# Altium project FPGA_Rack_v1_0.PrjPcb (part 1 of 2)
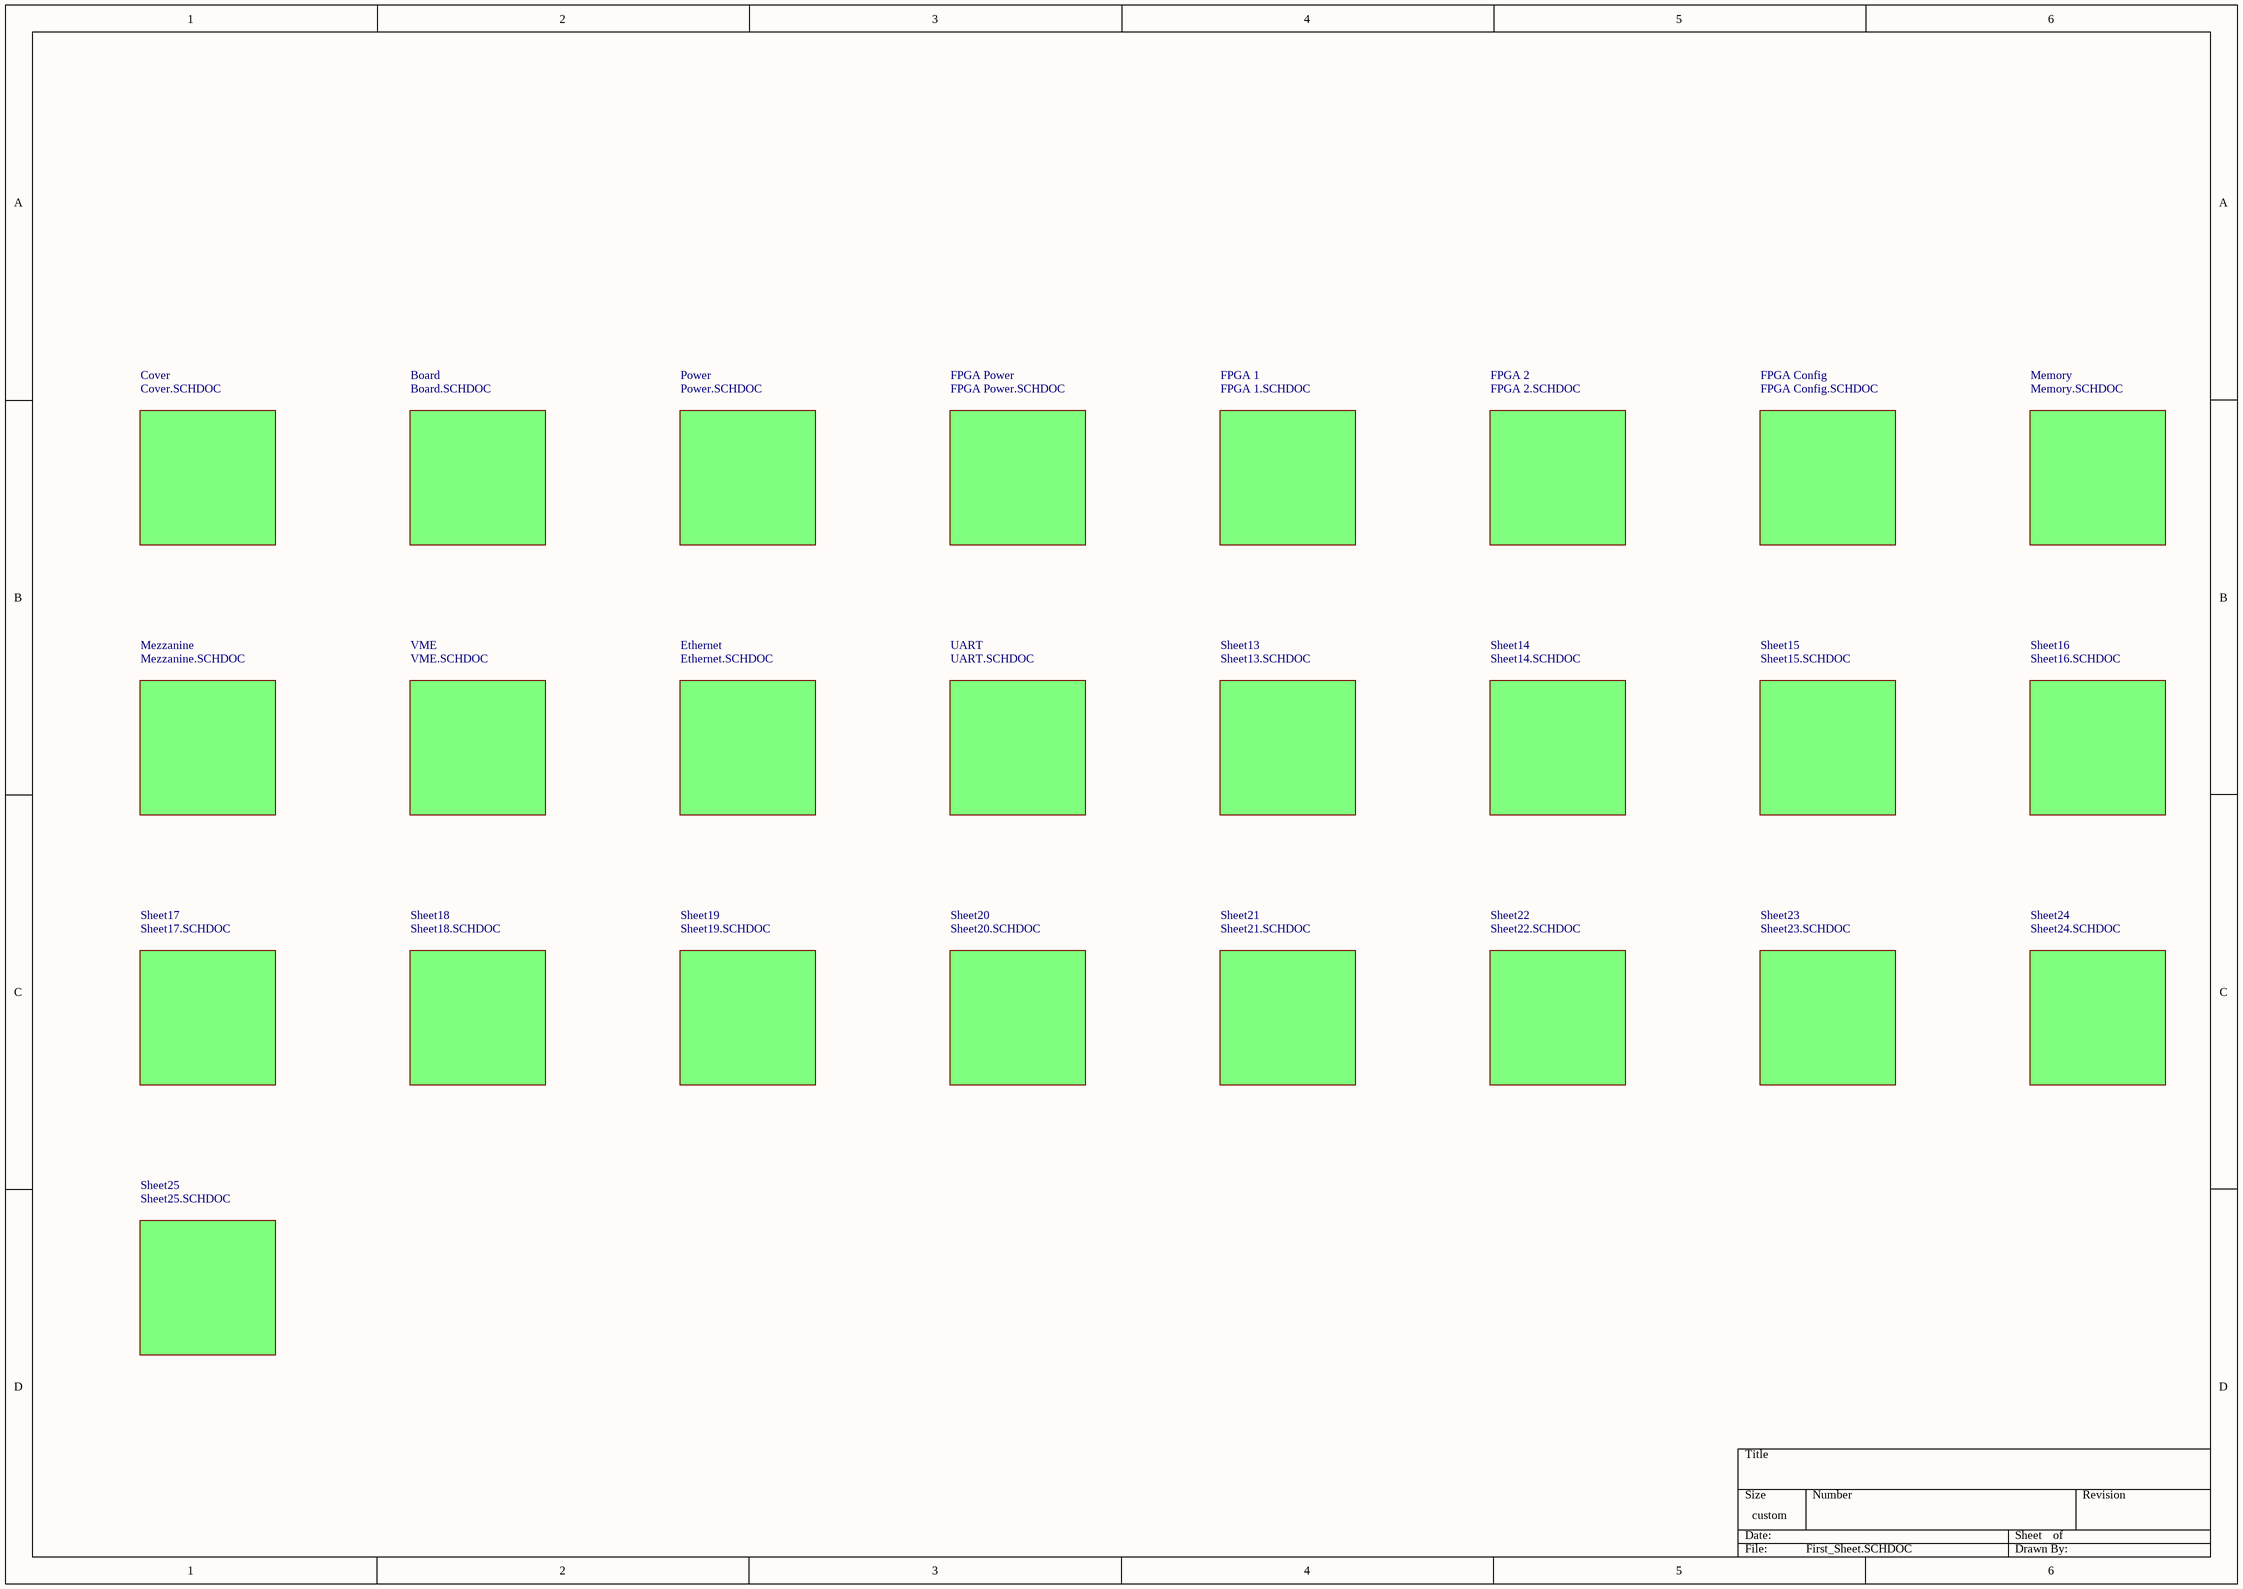
[diagram p0: First_Sheet.SCHDOC]
25 sheets, 208 parts. Net scope: global (net labels, ports and power ports of the same name join across sheets).
Board file: FPGA_Rack_v1_0.PcbDoc
Sheets:
  First_Sheet.SCHDOC
    Cover = Cover.SCHDOC
    Board = Board.SCHDOC
    Power = Power.SCHDOC
    FPGA Power = FPGA Power.SCHDOC
    FPGA 1 = FPGA 1.SCHDOC
    FPGA 2 = FPGA 2.SCHDOC
    FPGA Config = FPGA Config.SCHDOC
    Memory = Memory.SCHDOC
    Mezzanine = Mezzanine.SCHDOC
    Ethernet = Ethernet.SCHDOC
    UART = UART.SCHDOC
    Sheet13 = Sheet13.SCHDOC
    Sheet14 = Sheet14.SCHDOC
    Sheet15 = Sheet15.SCHDOC
    Sheet16 = Sheet16.SCHDOC
    Sheet17 = Sheet17.SCHDOC
    Sheet18 = Sheet18.SCHDOC
    Sheet19 = Sheet19.SCHDOC
    Sheet20 = Sheet20.SCHDOC
    Sheet21 = Sheet21.SCHDOC
    Sheet22 = Sheet22.SCHDOC
    Sheet23 = Sheet23.SCHDOC
    Sheet24 = Sheet24.SCHDOC
    Sheet25 = Sheet25.SCHDOC

## Sheet First_Sheet.SCHDOC
size 420 x 297 mm

### Sub-sheets
Board = Board.SCHDOC: no entries
Cover = Cover.SCHDOC: no entries
Ethernet = Ethernet.SCHDOC: no entries
FPGA 1 = FPGA 1.SCHDOC: no entries
FPGA 2 = FPGA 2.SCHDOC: no entries
FPGA Config = FPGA Config.SCHDOC: no entries
FPGA Power = FPGA Power.SCHDOC: no entries
Memory = Memory.SCHDOC: no entries
Mezzanine = Mezzanine.SCHDOC: no entries
Power = Power.SCHDOC: no entries
Sheet13 = Sheet13.SCHDOC: no entries
Sheet14 = Sheet14.SCHDOC: no entries
Sheet15 = Sheet15.SCHDOC: no entries
Sheet16 = Sheet16.SCHDOC: no entries
Sheet17 = Sheet17.SCHDOC: no entries
Sheet18 = Sheet18.SCHDOC: no entries
Sheet19 = Sheet19.SCHDOC: no entries
Sheet20 = Sheet20.SCHDOC: no entries
Sheet21 = Sheet21.SCHDOC: no entries
Sheet22 = Sheet22.SCHDOC: no entries
Sheet23 = Sheet23.SCHDOC: no entries
Sheet24 = Sheet24.SCHDOC: no entries
Sheet25 = Sheet25.SCHDOC: no entries
UART = UART.SCHDOC: no entries
VME = VME.SCHDOC (file not in this document): no entries

## Sheet Cover.SCHDOC: FPGA Rack
size 420 x 297 mm; DrawnBy: zas; Revision: V1.0; SheetNumber: 1; SheetTotal: 25; DocumentName: Cover.SCHDOC
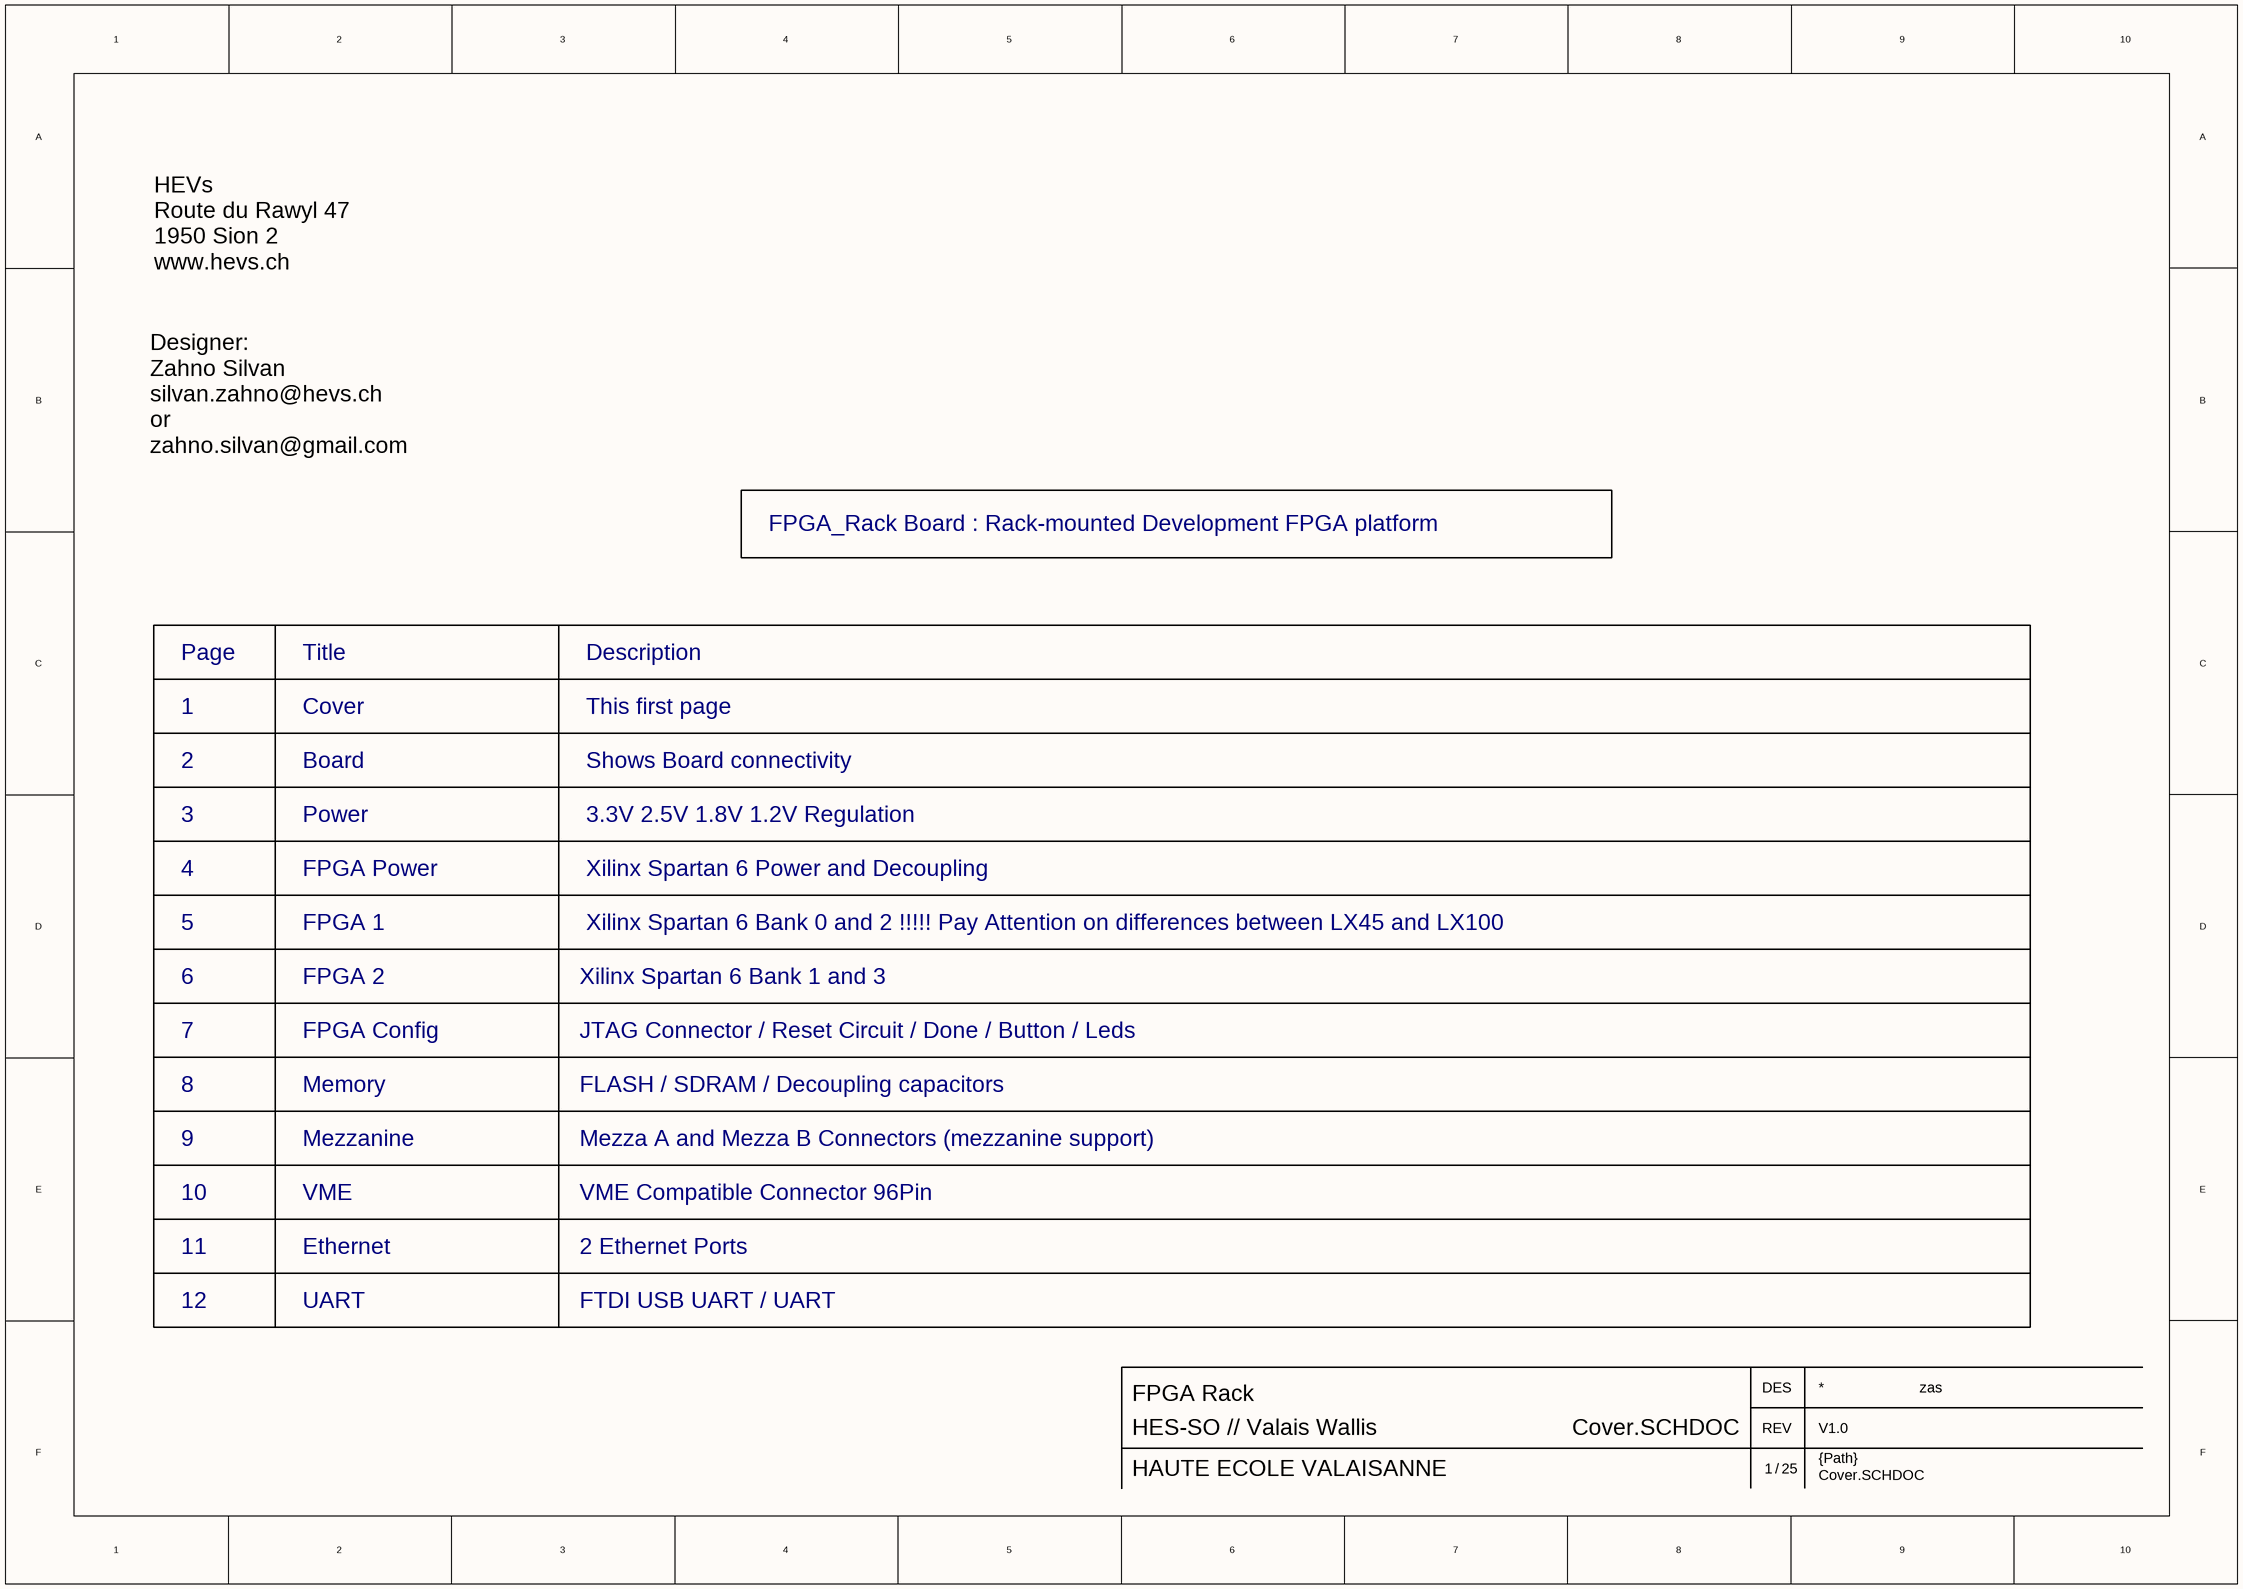
[diagram p1: Cover.SCHDOC]

### Notes on the sheet
- HEVs
  Route du Rawyl 47
  1950 Sion 2
  www.hevs.ch
- Designer:
  Zahno Silvan
  silvan.zahno@hevs.ch
  or
  zahno.silvan@gmail.com
- FPGA_Rack Board : Rack-mounted Development FPGA platform
- Page
- Title
- Description
- 1
- Cover
- This first page
- 2
- Board
- Shows Board connectivity
- 4
- 3
- FPGA Power
- Power
- Xilinx Spartan 6 Power and Decoupling
- 3.3V 2.5V 1.8V 1.2V Regulation
- 5
- FPGA 1
- Xilinx Spartan 6 Bank 0 and 2 !!!!! Pay Attention on differences between LX45 and LX100
- 6
- FPGA 2
- Xilinx Spartan 6 Bank 1 and 3
- 7
- FPGA Config
- JTAG Connector / Reset Circuit / Done / Button / Leds
- 9
- 8
- Mezzanine
- Memory
- Mezza A and Mezza B Connectors (mezzanine support)
- FLASH / SDRAM / Decoupling capacitors
- 10
- VME
- VME Compatible Connector 96Pin
- 11
- Ethernet
- 2 Ethernet Ports
- 12
- UART
- FTDI USB UART / UART
- DES
- HES-SO // Valais Wallis
- HAUTE ECOLE VALAISANNE
- /
- REV
- {Path}

## Sheet Board.SCHDOC: FPGA Rack
size 420 x 297 mm; DrawnBy: zas; Revision: V1.0; SheetNumber: 2; SheetTotal: 25; DocumentName: Board.SCHDOC
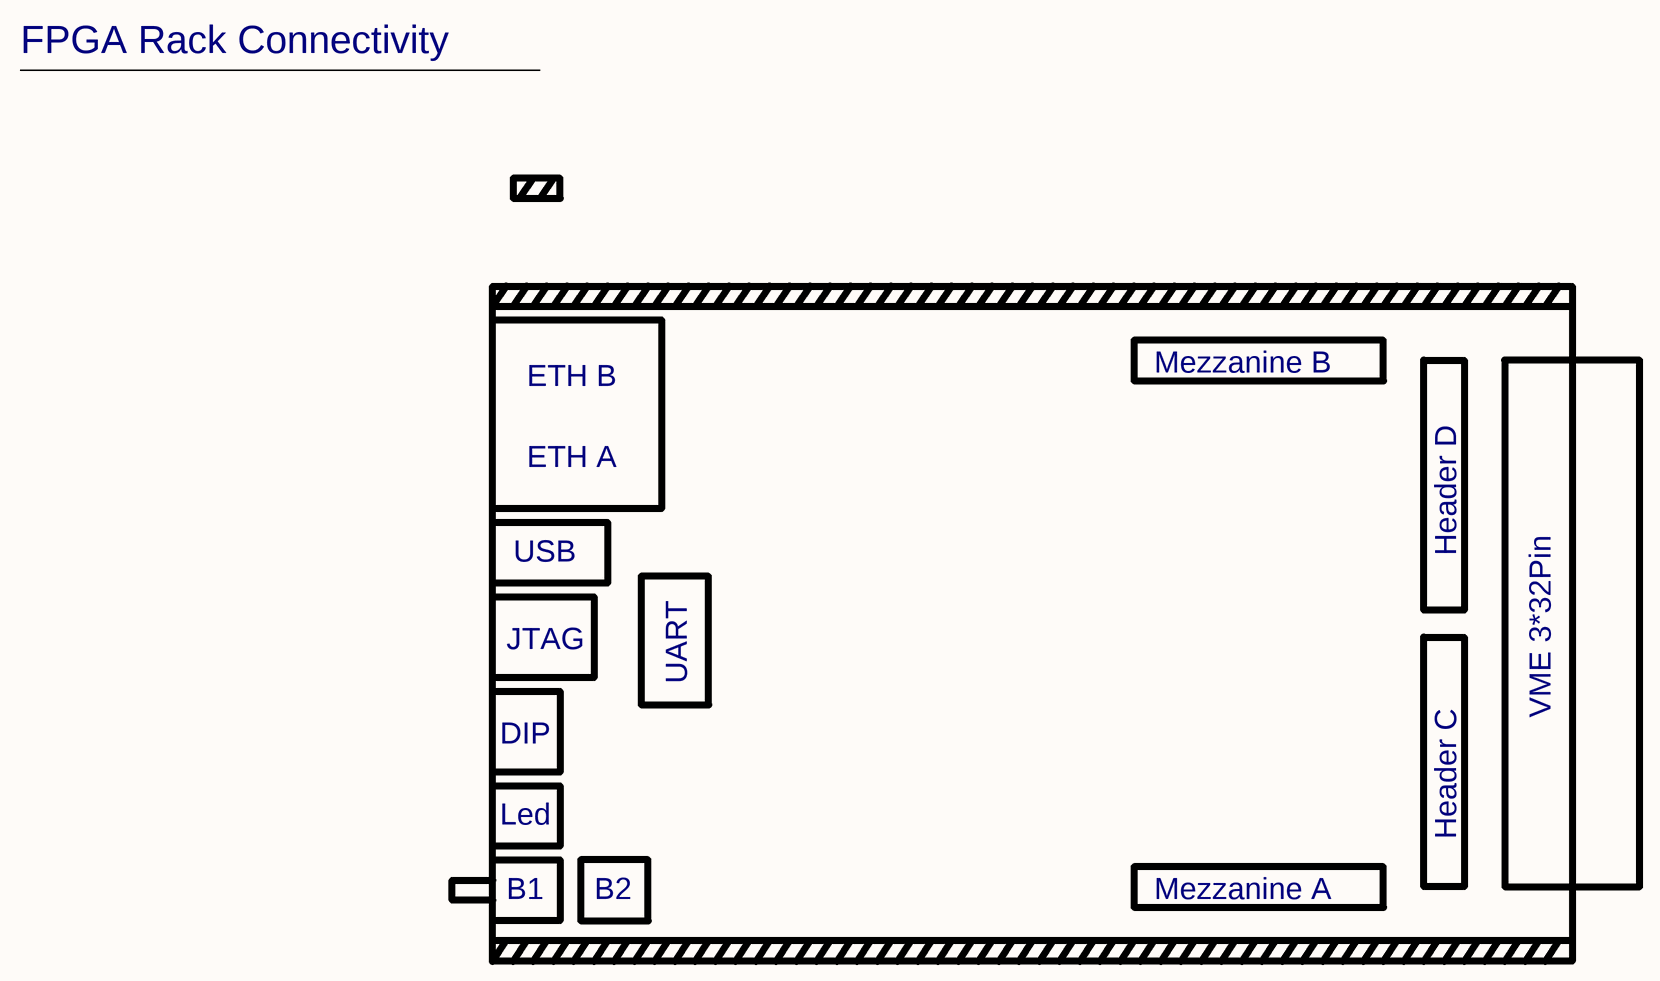
[diagram p2: Board.SCHDOC]

### Notes on the sheet
- FPGA Rack Connectivity
- Mezzanine B
- ETH B
- ETH A
- USB
- Header D
- JTAG
- UART
- VME 3*32Pin
- DIP
- Led
- Header C
- B1
- B2
- Mezzanine A
- DES
- HES-SO // Valais Wallis
- HAUTE ECOLE VALAISANNE
- /
- REV
- {Path}

## Sheet Power.SCHDOC: FPGA Rack
size 420 x 297 mm; DrawnBy: zas; Revision: V1.0; SheetNumber: 3; SheetTotal: 25; DocumentName: Power.SCHDOC
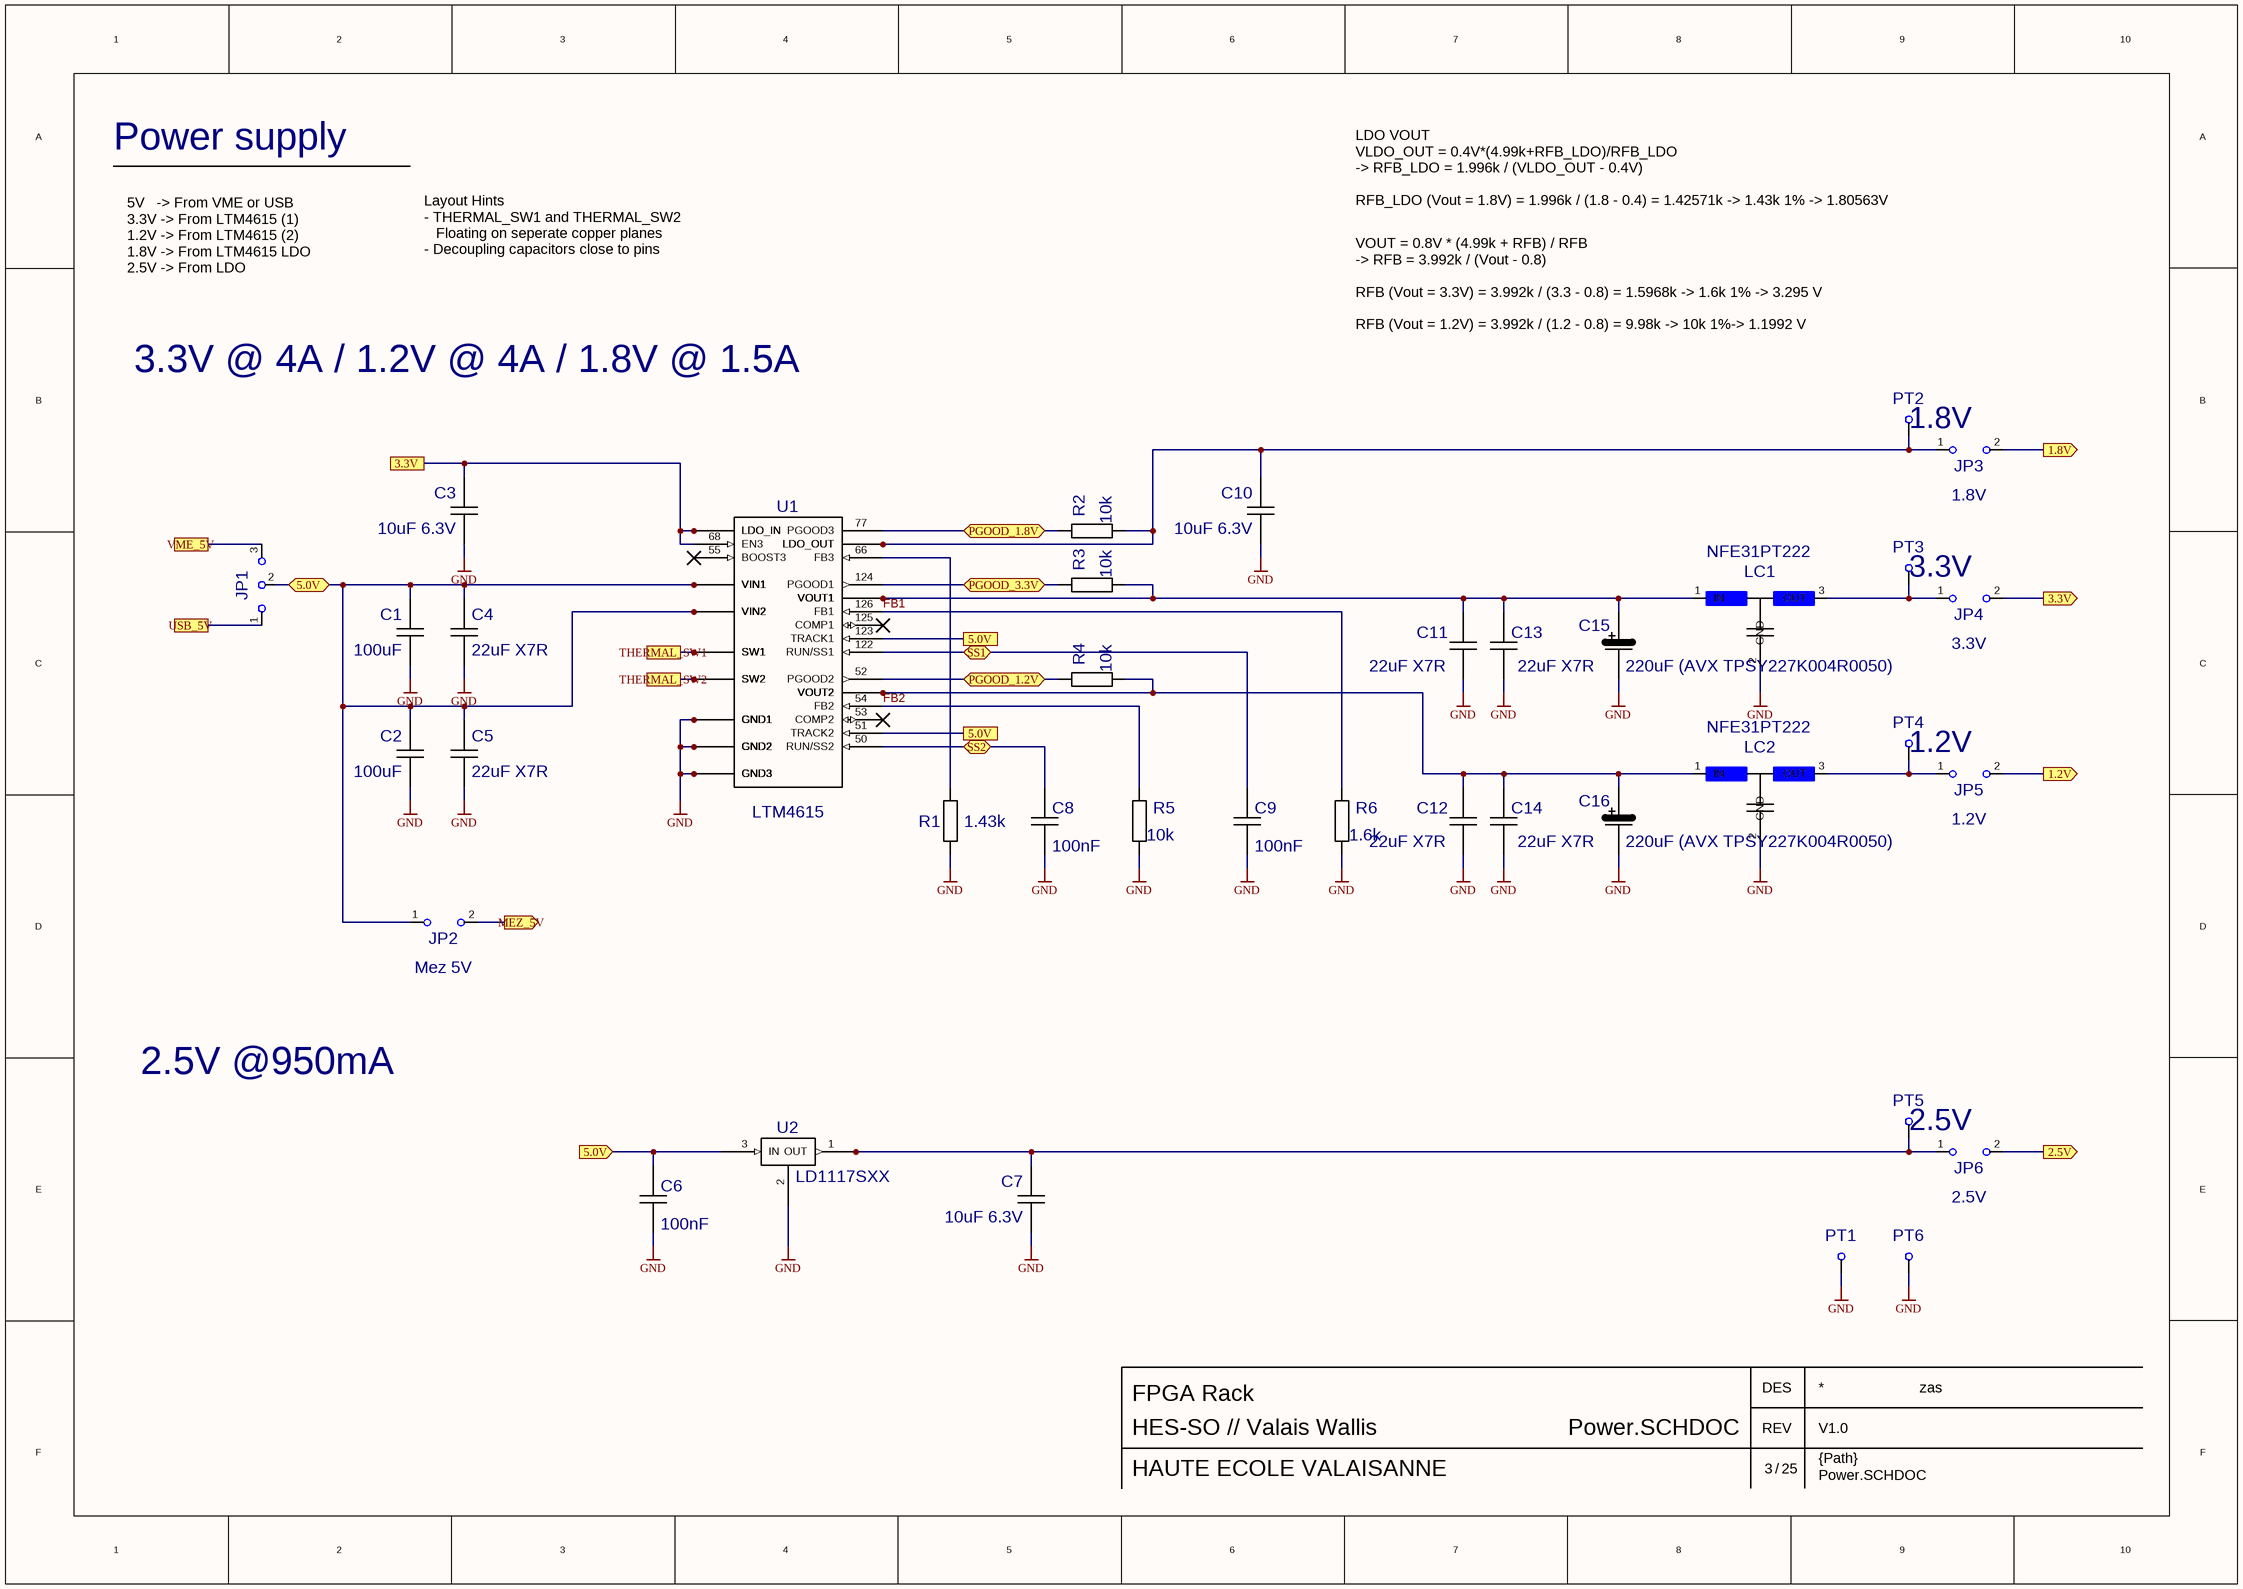
[diagram p3: Power.SCHDOC]

### Parts
C1  value 100uF  [CC1206]  (hidden comment: CAPS1206)
C2  value 100uF  [CC1206]  (hidden comment: CAPS1206)
C3  value 10uF 6.3V  [CC0805]  (hidden comment: CAPS0805)
C4  value 22uF X7R  [CC1206]  (hidden comment: CAPS1206)
C5  value 22uF X7R  [CC1206]  (hidden comment: CAPS1206)
C6  value 100nF  [CC0805]  (hidden comment: CAPS0805)
C7  value 10uF 6.3V  [CC0805]  (hidden comment: CAPS0805)
C8  value 100nF  [RC0603/0805]  (hidden comment: CAPS0603/0805)
C9  value 100nF  [RC0603/0805]  (hidden comment: CAPS0603/0805)
C10  value 10uF 6.3V  [CC0805]  (hidden comment: CAPS0805)
C11  value 22uF X7R  [CC1206]  (hidden comment: CAPS1206)
C12  value 22uF X7R  [CC1206]  (hidden comment: CAPS1206)
C13  value 22uF X7R  [CC1206]  (hidden comment: CAPS1206)
C14  value 22uF X7R  [CC1206]  (hidden comment: CAPS1206)
C15  value 220uF (AVX TPSY227K004R0050)  [TC7343]  (hidden comment: CAPS7343P(TAJ-D))
C16  value 220uF (AVX TPSY227K004R0050)  [TC7343]  (hidden comment: CAPS7343P(TAJ-D))
JP1  JUMPER-3  [JUMPER3]  (value not drawn)
JP2  value Mez 5V  [JUMPER-SMD]  (hidden comment: JUMPER-SMD)
JP3  value 1.8V  [JUMPER-SMD]  (hidden comment: JUMPER-SMD)
JP4  value 3.3V  [JUMPER-SMD]  (hidden comment: JUMPER-SMD)
JP5  value 1.2V  [JUMPER-SMD]  (hidden comment: JUMPER-SMD)
JP6  value 2.5V  [JUMPER-SMD]  (hidden comment: JUMPER-SMD)
LC1  value NFE31PT222  [NFE31P]  (hidden comment: NFE31P)
LC2  value NFE31PT222  [NFE31P]  (hidden comment: NFE31P)
PT1  PTEST  [CONN1X1M]  (value not drawn)
PT2  value 1.8V  [CONN1X1M]  (hidden comment: PTEST)
PT3  value 3.3V  [CONN1X1M]  (hidden comment: PTEST)
PT4  value 1.2V  [CONN1X1M]  (hidden comment: PTEST)
PT5  value 2.5V  [CONN1X1M]  (hidden comment: PTEST)
PT6  PTEST  [CONN1X1M]  (value not drawn)
R1  value 1.43k  [RC0603/0805]  (hidden comment: RS0603/0805)
R2  value 10k  [RC0603/0805]  (hidden comment: RS0603/0805)
R3  value 10k  [RC0603/0805]  (hidden comment: RS0603/0805)
R4  value 10k  [RC0603/0805]  (hidden comment: RS0603/0805)
R5  value 10k  [RC0603/0805]  (hidden comment: RS0603/0805)
R6  value 1.6k  [RC0603/0805]  (hidden comment: RS0603/0805)
U1  LTM4615  [LGA144_15X15MM]
U2  LD1117SXX  [SOT223]

### Ports
1.2V (out), 1.8V (out), 2.5V (out), 3.3V, 3.3V (out), 5.0V, 5.0V (bidir), 5.0V (in), MEZ_5V (out), PGOOD_1.2V (bidir), PGOOD_1.8V (bidir), PGOOD_3.3V (bidir), SS1 (bidir), SS2 (bidir), THERMAL_SW1, THERMAL_SW2, USB_5V, VME_5V

### Nets
GND: C1.1 C2.1 C3.1 C4.1 C5.1 C6.1 C7.1 C8.1 C9.1 C10.1 C11.1 C12.1 C13.1 C14.1 C15.MINUS(-) C16.MINUS(-) LC1.2(GND) LC2.2(GND) PT1.1(A) PT6.1(A) R1.1 R5.1 R6.1 U1.1(GND2) U1.2(GND2) U1.3(GND2) U1.4(GND2) U1.5(GND2) U1.6(GND2) U1.7(GND2) U1.8(GND2) U1.9(GND2) U1.10(GND2) U1.11(GND2) U1.12(GND2) U1.13(GND2) U1.19(GND2) U1.20(GND2) U1.21(GND2) U1.22(GND2) U1.23(GND2) U1.24(GND2) U1.31(GND2) U1.32(GND2) U1.42(GND2) U1.43(GND2) U1.44(GND2) U1.49(GND2) U1.56(GND2) U1.57(GND2) U1.58(GND2) U1.61(GND3) U1.62(GND3) U1.63(GND3) U1.64(GND3) U1.65(GND3) U1.67(GND3) U1.69(GND3) U1.70(GND3) U1.71(GND3) U1.72(GND3) U1.78(GND3) U1.79(GND3) U1.80(GND3) U1.85(GND1) U1.91(GND1) U1.92(GND1) U1.93(GND1) U1.94(GND1) U1.95(GND1) U1.96(GND1) U1.102(GND1) U1.103(GND1) U1.104(GND1) U1.105(GND1) U1.106(GND1) U1.107(GND1) U1.108(GND1) U1.114(GND1) U1.115(GND1) U1.116(GND1) U1.121(GND1) U1.127(GND1) U1.128(GND1) U1.133(GND1) U1.134(GND1) U1.135(GND1) U1.136(GND1) U1.137(GND1) U1.138(GND1) U1.139(GND1) U1.140(GND1) U2.2(GND)
1.2V: JP5.2 ; port 1.2V
1.8V: JP3.2 ; port 1.8V
2.5V: JP6.2 ; port 2.5V
3.3V: C3.2 JP4.2 U1.68(EN3) U1.73(LDO_IN) U1.74(LDO_IN) U1.75(LDO_IN) U1.76(LDO_IN) ; port 3.3V
5.0V: C1.2 C2.2 C4.2 C5.2 C6.2 JP1.2 JP2.1 U1.25(VIN2) U1.26(VIN2) U1.27(VIN2) U1.28(VIN2) U1.29(VIN2) U1.30(VIN2) U1.37(VIN2) U1.38(VIN2) U1.39(VIN2) U1.40(VIN2) U1.41(VIN2) U1.51(TRACK2) U1.97(VIN1) U1.98(VIN1) U1.99(VIN1) U1.100(VIN1) U1.101(VIN1) U1.109(VIN1) U1.110(VIN1) U1.111(VIN1) U1.112(VIN1) U1.113(VIN1) U1.123(TRACK1) U2.3(IN) ; port 5.0V
FB1: R6.2 U1.126(FB1)
FB2: R5.2 U1.54(FB2)
MEZ_5V: JP2.2 ; port MEZ_5V
PGOOD_1.2V: R4.2 U1.52(PGOOD2) ; port PGOOD_1.2V
PGOOD_1.8V: R2.2 U1.77(PGOOD3) ; port PGOOD_1.8V
PGOOD_3.3V: R3.2 U1.124(PGOOD1) ; port PGOOD_3.3V
SS1: C9.2 U1.122(RUN/SS1) ; port SS1
SS2: C8.2 U1.50(RUN/SS2) ; port SS2
THERMAL_SW1: U1.86(SW1) U1.87(SW1) U1.88(SW1) U1.89(SW1) U1.90(SW1) ; port THERMAL_SW1
THERMAL_SW2: U1.14(SW2) U1.15(SW2) U1.16(SW2) U1.17(SW2) U1.18(SW2) ; port THERMAL_SW2
USB_5V: JP1.1 ; port USB_5V
VME_5V: JP1.3 ; port VME_5V
NetC7_2: C7.2 JP6.1 PT5.1(A) U2.1(OUT) U2.4(OUT)
NetC10_2: C10.2 JP3.1 PT2.1(A) R2.1 U1.81(LDO_OUT) U1.82(LDO_OUT) U1.83(LDO_OUT) U1.84(LDO_OUT)
NetC11_2: C11.2 C13.2 C15.PLUS(+) LC1.1(IN) R3.1 U1.117(VOUT1) U1.118(VOUT1) U1.119(VOUT1) U1.120(VOUT1) U1.129(VOUT1) U1.130(VOUT1) U1.131(VOUT1) U1.132(VOUT1) U1.141(VOUT1) U1.142(VOUT1) U1.143(VOUT1) U1.144(VOUT1)
NetC12_2: C12.2 C14.2 C16.PLUS(+) LC2.1(IN) R4.1 U1.33(VOUT2) U1.34(VOUT2) U1.35(VOUT2) U1.36(VOUT2) U1.45(VOUT2) U1.46(VOUT2) U1.47(VOUT2) U1.48(VOUT2) U1.59(VOUT2) U1.60(VOUT2)
NetJP4_1: JP4.1 LC1.3(OUT) PT3.1(A)
NetJP5_1: JP5.1 LC2.3(OUT) PT4.1(A)
NetR1_2: R1.2 U1.66(FB3)

Not connected (* = marked no-connect by the designer): U1 53(COMP2) 55(BOOST3) 125(COMP1)

### Notes on the sheet
- Power supply
- LDO VOUT
  VLDO_OUT = 0.4V*(4.99k+RFB_LDO)/RFB_LDO
  -> RFB_LDO = 1.996k / (VLDO_OUT - 0.4V)
  RFB_LDO (Vout = 1.8V) = 1.996k / (1.8 - 0.4) = 1.42571k -> 1.43k 1% -> 1.80563V
- 5V   -> From VME or USB
  3.3V -> From LTM4615 (1)
  1.2V -> From LTM4615 (2)
  1.8V -> From LTM4615 LDO
  2.5V -> From LDO
- Layout Hints
  - THERMAL_SW1 and THERMAL_SW2
  Floating on seperate copper planes
  - Decoupling capacitors close to pins
- 3.3V @ 4A / 1.2V @ 4A / 1.8V @ 1.5A
- VOUT = 0.8V * (4.99k + RFB) / RFB
  -> RFB = 3.992k / (Vout - 0.8)
  RFB (Vout = 3.3V) = 3.992k / (3.3 - 0.8) = 1.5968k -> 1.6k 1% -> 3.295 V
  RFB (Vout = 1.2V) = 3.992k / (1.2 - 0.8) = 9.98k -> 10k 1%-> 1.1992 V
- 2.5V @950mA
- DES
- HES-SO // Valais Wallis
- HAUTE ECOLE VALAISANNE
- /
- REV
- {Path}

### Library data of the parts
C1 C2 C4 C5 C11-C14 = CAPS1206: Capacitor
C3 C6 C7 C10 = CAPS0805: Capacitor
C8 C9 = CAPS0603/0805: Valable pour formats 0805 et 1206
JP2-JP6 = JUMPER-SMD: use: power supply 3.3
LC1 LC2 = NFE31P: EMI filter - TDK; use: power supply 3.3
PT1-PT6 = PTEST: Partition: Power; RefDes2: {RefDes2}; MEZZAONLY: YES
R1-R6 = RS0603/0805: Valable pour format 0805 et 1206
U2 = LD1117SXX: 3A Low Dropout positive Regulator; Value: *
U1 = LTM4615: Value: *

## Sheet FPGA Power.SCHDOC: FPGA Rack
size 420 x 297 mm; DrawnBy: zas; Revision: V1.0; SheetNumber: 4; SheetTotal: 25; DocumentName: FPGA Power.SCHDOC
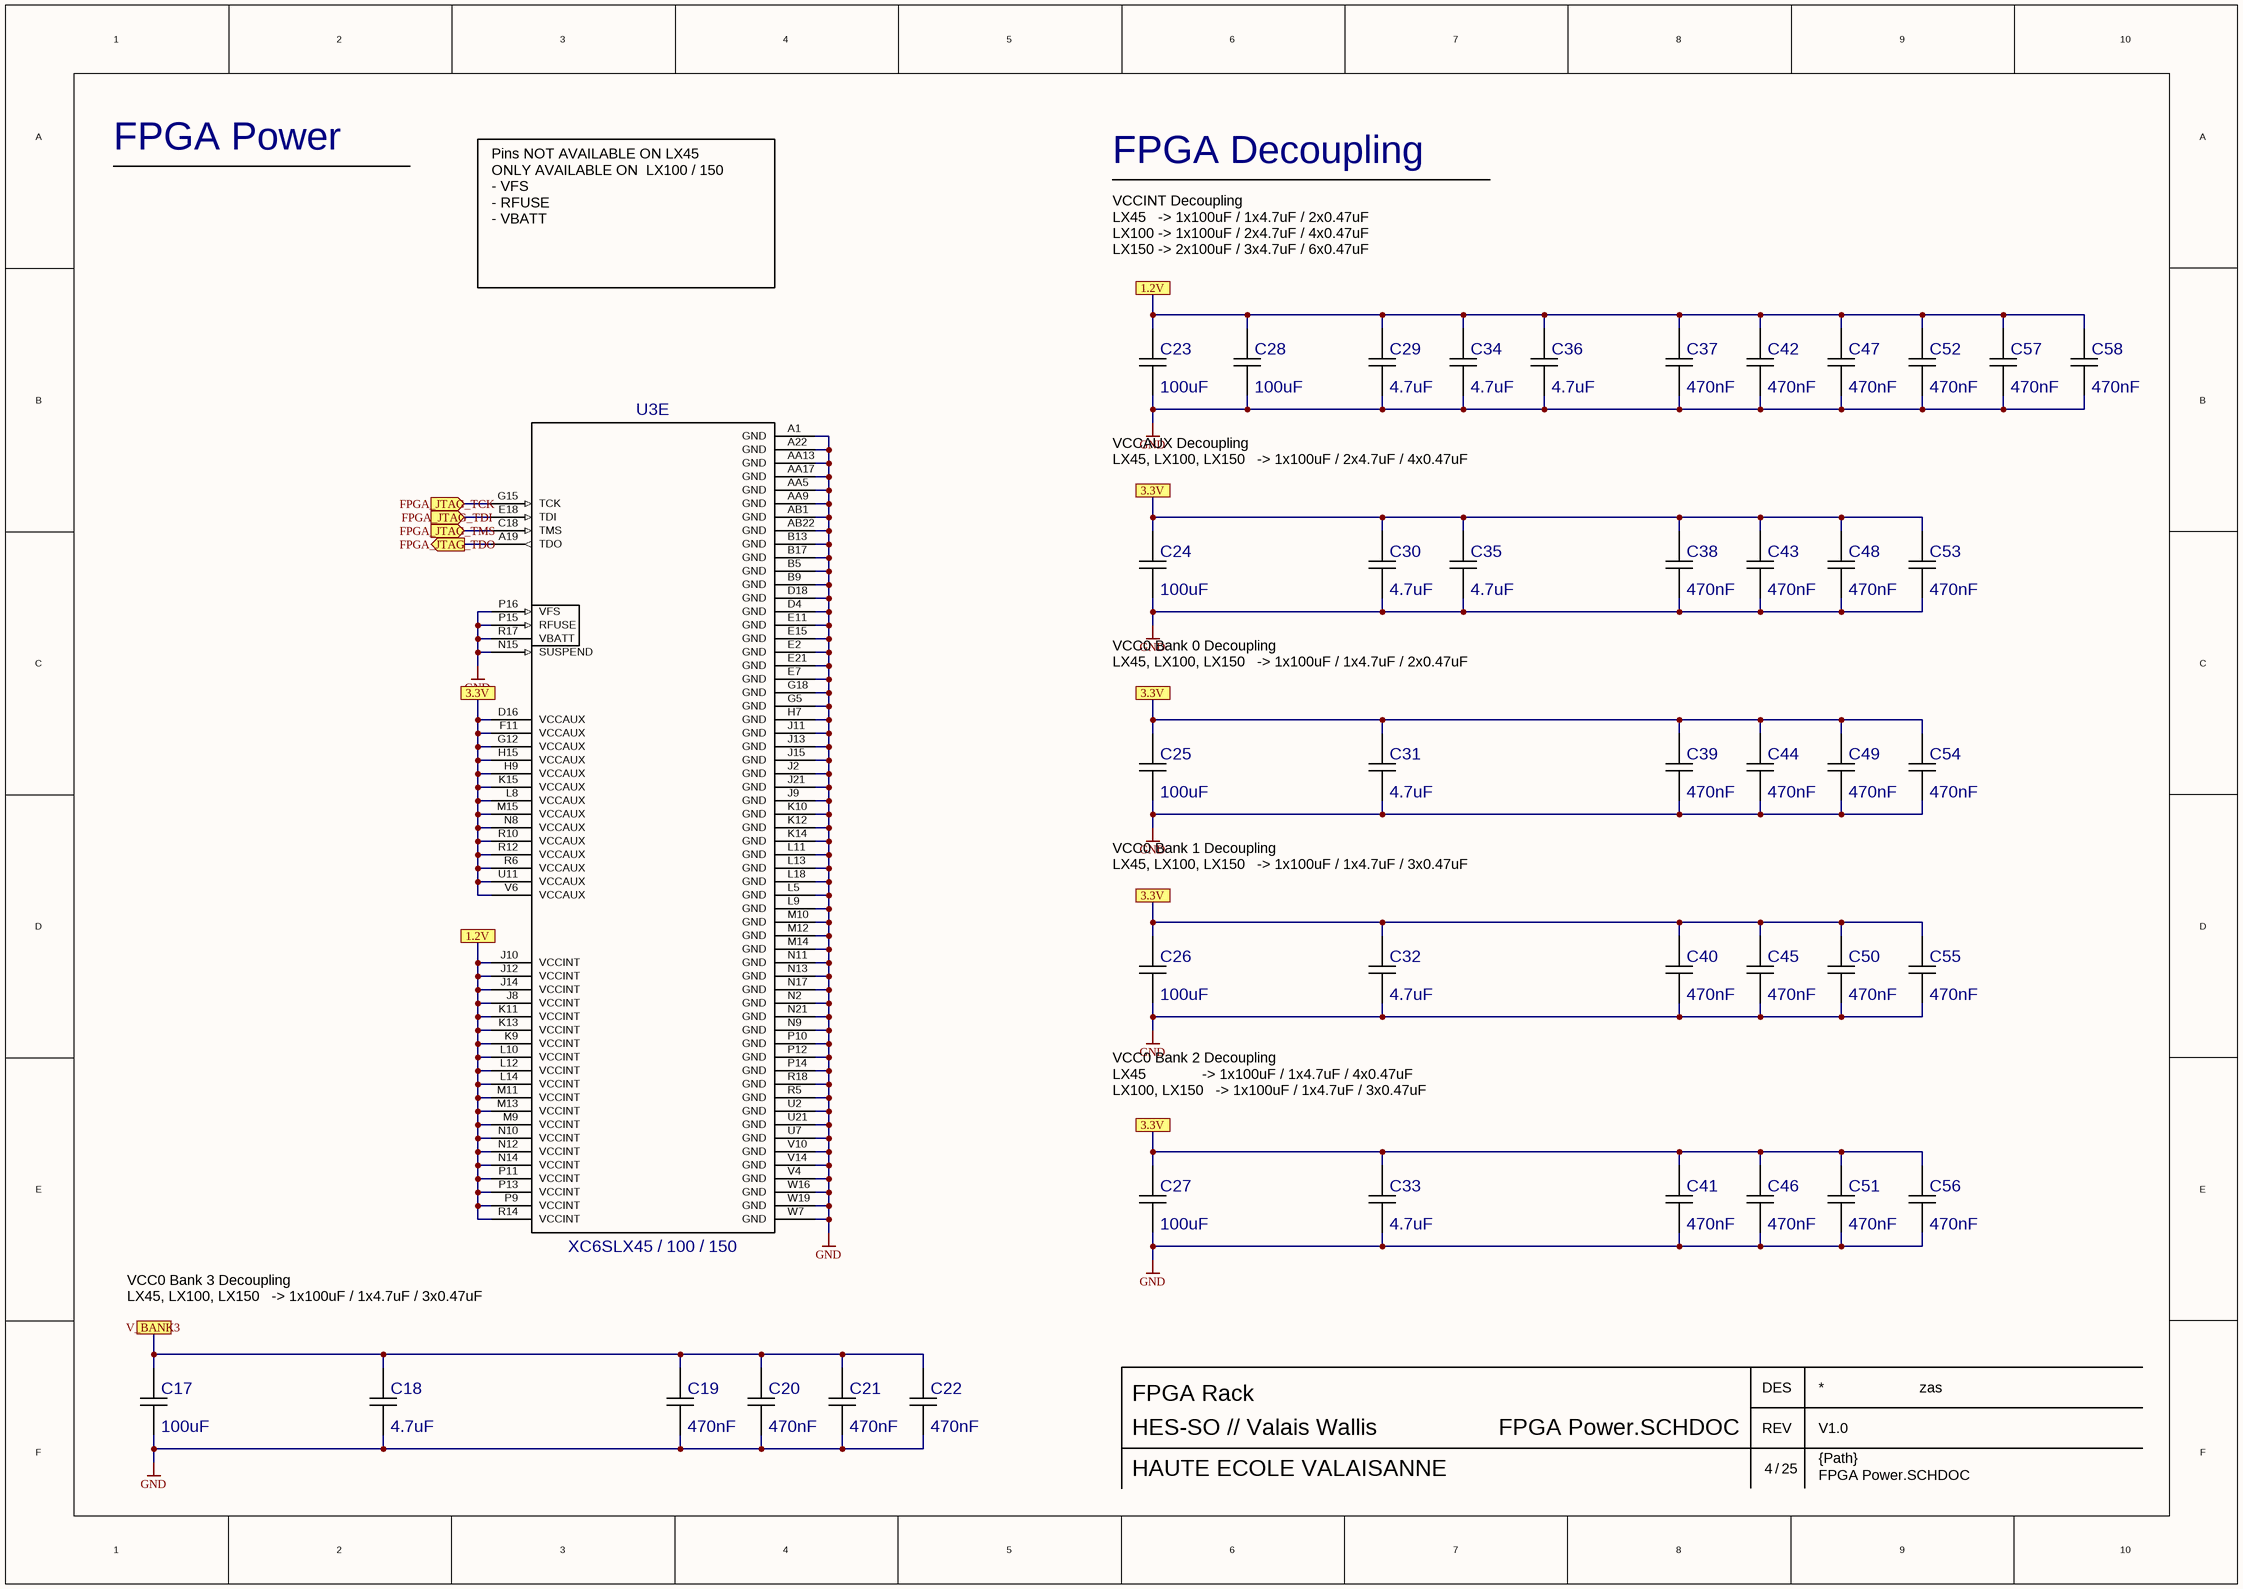
[diagram p4: FPGA Power.SCHDOC]

### Parts
C17  value 100uF  [CC1206-MM]  (hidden comment: CAPS1206-MM)
C18  value 4.7uF  [CC0805-MM]  (hidden comment: CAPS0805-MM)
C19  value 470nF  [RC0603-MM]  (hidden comment: CAPS0603-MM)
C20  value 470nF  [RC0603-MM]  (hidden comment: CAPS0603-MM)
C21  value 470nF  [RC0603-MM]  (hidden comment: CAPS0603-MM)
C22  value 470nF  [RC0603-MM]  (hidden comment: CAPS0603-MM)
C23  value 100uF  [CC1206-MM]  (hidden comment: CAPS1206-MM)
C24  value 100uF  [CC1206-MM]  (hidden comment: CAPS1206-MM)
C25  value 100uF  [CC1206-MM]  (hidden comment: CAPS1206-MM)
C26  value 100uF  [CC1206-MM]  (hidden comment: CAPS1206-MM)
C27  value 100uF  [CC1206-MM]  (hidden comment: CAPS1206-MM)
C28  value 100uF  [CC1206-MM]  (hidden comment: CAPS1206-MM)
C29  value 4.7uF  [CC0805-MM]  (hidden comment: CAPS0805-MM)
C30  value 4.7uF  [CC0805-MM]  (hidden comment: CAPS0805-MM)
C31  value 4.7uF  [CC0805-MM]  (hidden comment: CAPS0805-MM)
C32  value 4.7uF  [CC0805-MM]  (hidden comment: CAPS0805-MM)
C33  value 4.7uF  [CC0805-MM]  (hidden comment: CAPS0805-MM)
C34  value 4.7uF  [CC0805-MM]  (hidden comment: CAPS0805-MM)
C35  value 4.7uF  [CC0805-MM]  (hidden comment: CAPS0805-MM)
C36  value 4.7uF  [CC0805-MM]  (hidden comment: CAPS0805-MM)
C37  value 470nF  [RC0603-MM]  (hidden comment: CAPS0603-MM)
C38  value 470nF  [RC0603-MM]  (hidden comment: CAPS0603-MM)
C39  value 470nF  [RC0603-MM]  (hidden comment: CAPS0603-MM)
C40  value 470nF  [RC0603-MM]  (hidden comment: CAPS0603-MM)
C41  value 470nF  [RC0603-MM]  (hidden comment: CAPS0603-MM)
C42  value 470nF  [RC0603-MM]  (hidden comment: CAPS0603-MM)
C43  value 470nF  [RC0603-MM]  (hidden comment: CAPS0603-MM)
C44  value 470nF  [RC0603-MM]  (hidden comment: CAPS0603-MM)
C45  value 470nF  [RC0603-MM]  (hidden comment: CAPS0603-MM)
C46  value 470nF  [RC0603-MM]  (hidden comment: CAPS0603-MM)
C47  value 470nF  [RC0603-MM]  (hidden comment: CAPS0603-MM)
C48  value 470nF  [RC0603-MM]  (hidden comment: CAPS0603-MM)
C49  value 470nF  [RC0603-MM]  (hidden comment: CAPS0603-MM)
C50  value 470nF  [RC0603-MM]  (hidden comment: CAPS0603-MM)
C51  value 470nF  [RC0603-MM]  (hidden comment: CAPS0603-MM)
C52  value 470nF  [RC0603-MM]  (hidden comment: CAPS0603-MM)
C53  value 470nF  [RC0603-MM]  (hidden comment: CAPS0603-MM)
C54  value 470nF  [RC0603-MM]  (hidden comment: CAPS0603-MM)
C55  value 470nF  [RC0603-MM]  (hidden comment: CAPS0603-MM)
C56  value 470nF  [RC0603-MM]  (hidden comment: CAPS0603-MM)
C57  value 470nF  [RC0603-MM]  (hidden comment: CAPS0603-MM)
C58  value 470nF  [RC0603-MM]  (hidden comment: CAPS0603-MM)
U3  value XC6SLX45 / 100 / 150  [BGA23X23-FG484]  (hidden comment: XC6SLX150 FGG484)  (part E of 5)

### Ports
1.2V, 3.3V, FPGA_JTAG_TCK (in), FPGA_JTAG_TDI (in), FPGA_JTAG_TDO (out), FPGA_JTAG_TMS (in), V_BANK3

### Nets
GND: C17.1 C18.1 C19.1 C20.1 C21.1 C22.1 C23.1 C24.1 C25.1 C26.1 C27.1 C28.1 C29.1 C30.1 C31.1 C32.1 C33.1 C34.1 C35.1 C36.1 C37.1 C38.1 C39.1 C40.1 C41.1 C42.1 C43.1 C44.1 C45.1 C46.1 C47.1 C48.1 C49.1 C50.1 C51.1 C52.1 C53.1 C54.1 C55.1 C56.1 C57.1 C58.1 U3.A1(GND) U3.A22(GND) U3.AA5(GND) U3.AA9(GND) U3.AA13(GND) U3.AA17(GND) U3.AB1(GND) U3.AB22(GND) U3.B5(GND) U3.B9(GND) U3.B13(GND) U3.B17(GND) U3.D4(GND) U3.D18(GND) U3.E2(GND) U3.E7(GND) U3.E11(GND) U3.E15(GND) U3.E21(GND) U3.G5(GND) U3.G18(GND) U3.H7(GND) U3.J2(GND) U3.J9(GND) U3.J11(GND) U3.J13(GND) U3.J15(GND) U3.J21(GND) U3.K10(GND) U3.K12(GND) U3.K14(GND) U3.L5(GND) U3.L9(GND) U3.L11(GND) U3.L13(GND) U3.L18(GND) U3.M10(GND) U3.M12(GND) U3.M14(GND) U3.N2(GND) U3.N9(GND) U3.N11(GND) U3.N13(GND) U3.N15(SUSPEND) U3.N17(GND) U3.N21(GND) U3.P10(GND) U3.P12(GND) U3.P14(GND) U3.P15(RFUSE) U3.P16(VFS) U3.R5(GND) U3.R17(VBATT) U3.R18(GND) U3.U2(GND) U3.U7(GND) U3.U21(GND) U3.V4(GND) U3.V10(GND) U3.V14(GND) U3.W7(GND) U3.W16(GND) U3.W19(GND)
FPGA_JTAG_TCK: U3.G15(TCK) ; port FPGA_JTAG_TCK
FPGA_JTAG_TDI: U3.E18(TDI) ; port FPGA_JTAG_TDI
FPGA_JTAG_TDO: U3.A19(TDO) ; port FPGA_JTAG_TDO
FPGA_JTAG_TMS: U3.C18(TMS) ; port FPGA_JTAG_TMS
NetC17_2: C17.2 C18.2 C19.2 C20.2 C21.2 C22.2
NetC23_2: C23.2 C28.2 C29.2 C34.2 C36.2 C37.2 C42.2 C47.2 C52.2 C57.2 C58.2
NetC24_2: C24.2 C30.2 C35.2 C38.2 C43.2 C48.2 C53.2
NetC25_2: C25.2 C31.2 C39.2 C44.2 C49.2 C54.2
NetC26_2: C26.2 C32.2 C40.2 C45.2 C50.2 C55.2
NetC27_2: C27.2 C33.2 C41.2 C46.2 C51.2 C56.2
NetU3_D16: U3.D16(VCCAUX) U3.F11(VCCAUX) U3.G12(VCCAUX) U3.H9(VCCAUX) U3.H15(VCCAUX) U3.K15(VCCAUX) U3.L8(VCCAUX) U3.M15(VCCAUX) U3.N8(VCCAUX) U3.R6(VCCAUX) U3.R10(VCCAUX) U3.R12(VCCAUX) U3.U11(VCCAUX) U3.V6(VCCAUX)
NetU3_J8: U3.J8(VCCINT) U3.J10(VCCINT) U3.J12(VCCINT) U3.J14(VCCINT) U3.K9(VCCINT) U3.K11(VCCINT) U3.K13(VCCINT) U3.L10(VCCINT) U3.L12(VCCINT) U3.L14(VCCINT) U3.M9(VCCINT) U3.M11(VCCINT) U3.M13(VCCINT) U3.N10(VCCINT) U3.N12(VCCINT) U3.N14(VCCINT) U3.P9(VCCINT) U3.P11(VCCINT) U3.P13(VCCINT) U3.R14(VCCINT)

### Notes on the sheet
- FPGA Power
- FPGA Decoupling
- Pins NOT AVAILABLE ON LX45
  ONLY AVAILABLE ON  LX100 / 150
  - VFS
  - RFUSE
  - VBATT
- VCCINT Decoupling
  LX45   -> 1x100uF / 1x4.7uF / 2x0.47uF
  LX100 -> 1x100uF / 2x4.7uF / 4x0.47uF
  LX150 -> 2x100uF / 3x4.7uF / 6x0.47uF
- VCCAUX Decoupling
  LX45, LX100, LX150   -> 1x100uF / 2x4.7uF / 4x0.47uF
- VCC0 Bank 0 Decoupling
  LX45, LX100, LX150   -> 1x100uF / 1x4.7uF / 2x0.47uF
- VCC0 Bank 1 Decoupling
  LX45, LX100, LX150   -> 1x100uF / 1x4.7uF / 3x0.47uF
- VCC0 Bank 2 Decoupling
  LX45              -> 1x100uF / 1x4.7uF / 4x0.47uF
  LX100, LX150   -> 1x100uF / 1x4.7uF / 3x0.47uF
- VCC0 Bank 3 Decoupling
  LX45, LX100, LX150   -> 1x100uF / 1x4.7uF / 3x0.47uF
- DES
- HES-SO // Valais Wallis
- HAUTE ECOLE VALAISANNE
- /
- REV
- {Path}

### Library data of the parts
C17 C23-C28 = CAPS1206-MM: Capacitor
C18 C29-C36 = CAPS0805-MM: Capacitor
C19-C22 C37-C58 = CAPS0603-MM: Capacitor

## Sheet FPGA 1.SCHDOC: FPGA Rack
size 420 x 297 mm; DrawnBy: zas; Revision: V1.0; SheetNumber: 5; SheetTotal: 25; DocumentName: FPGA 1.SCHDOC
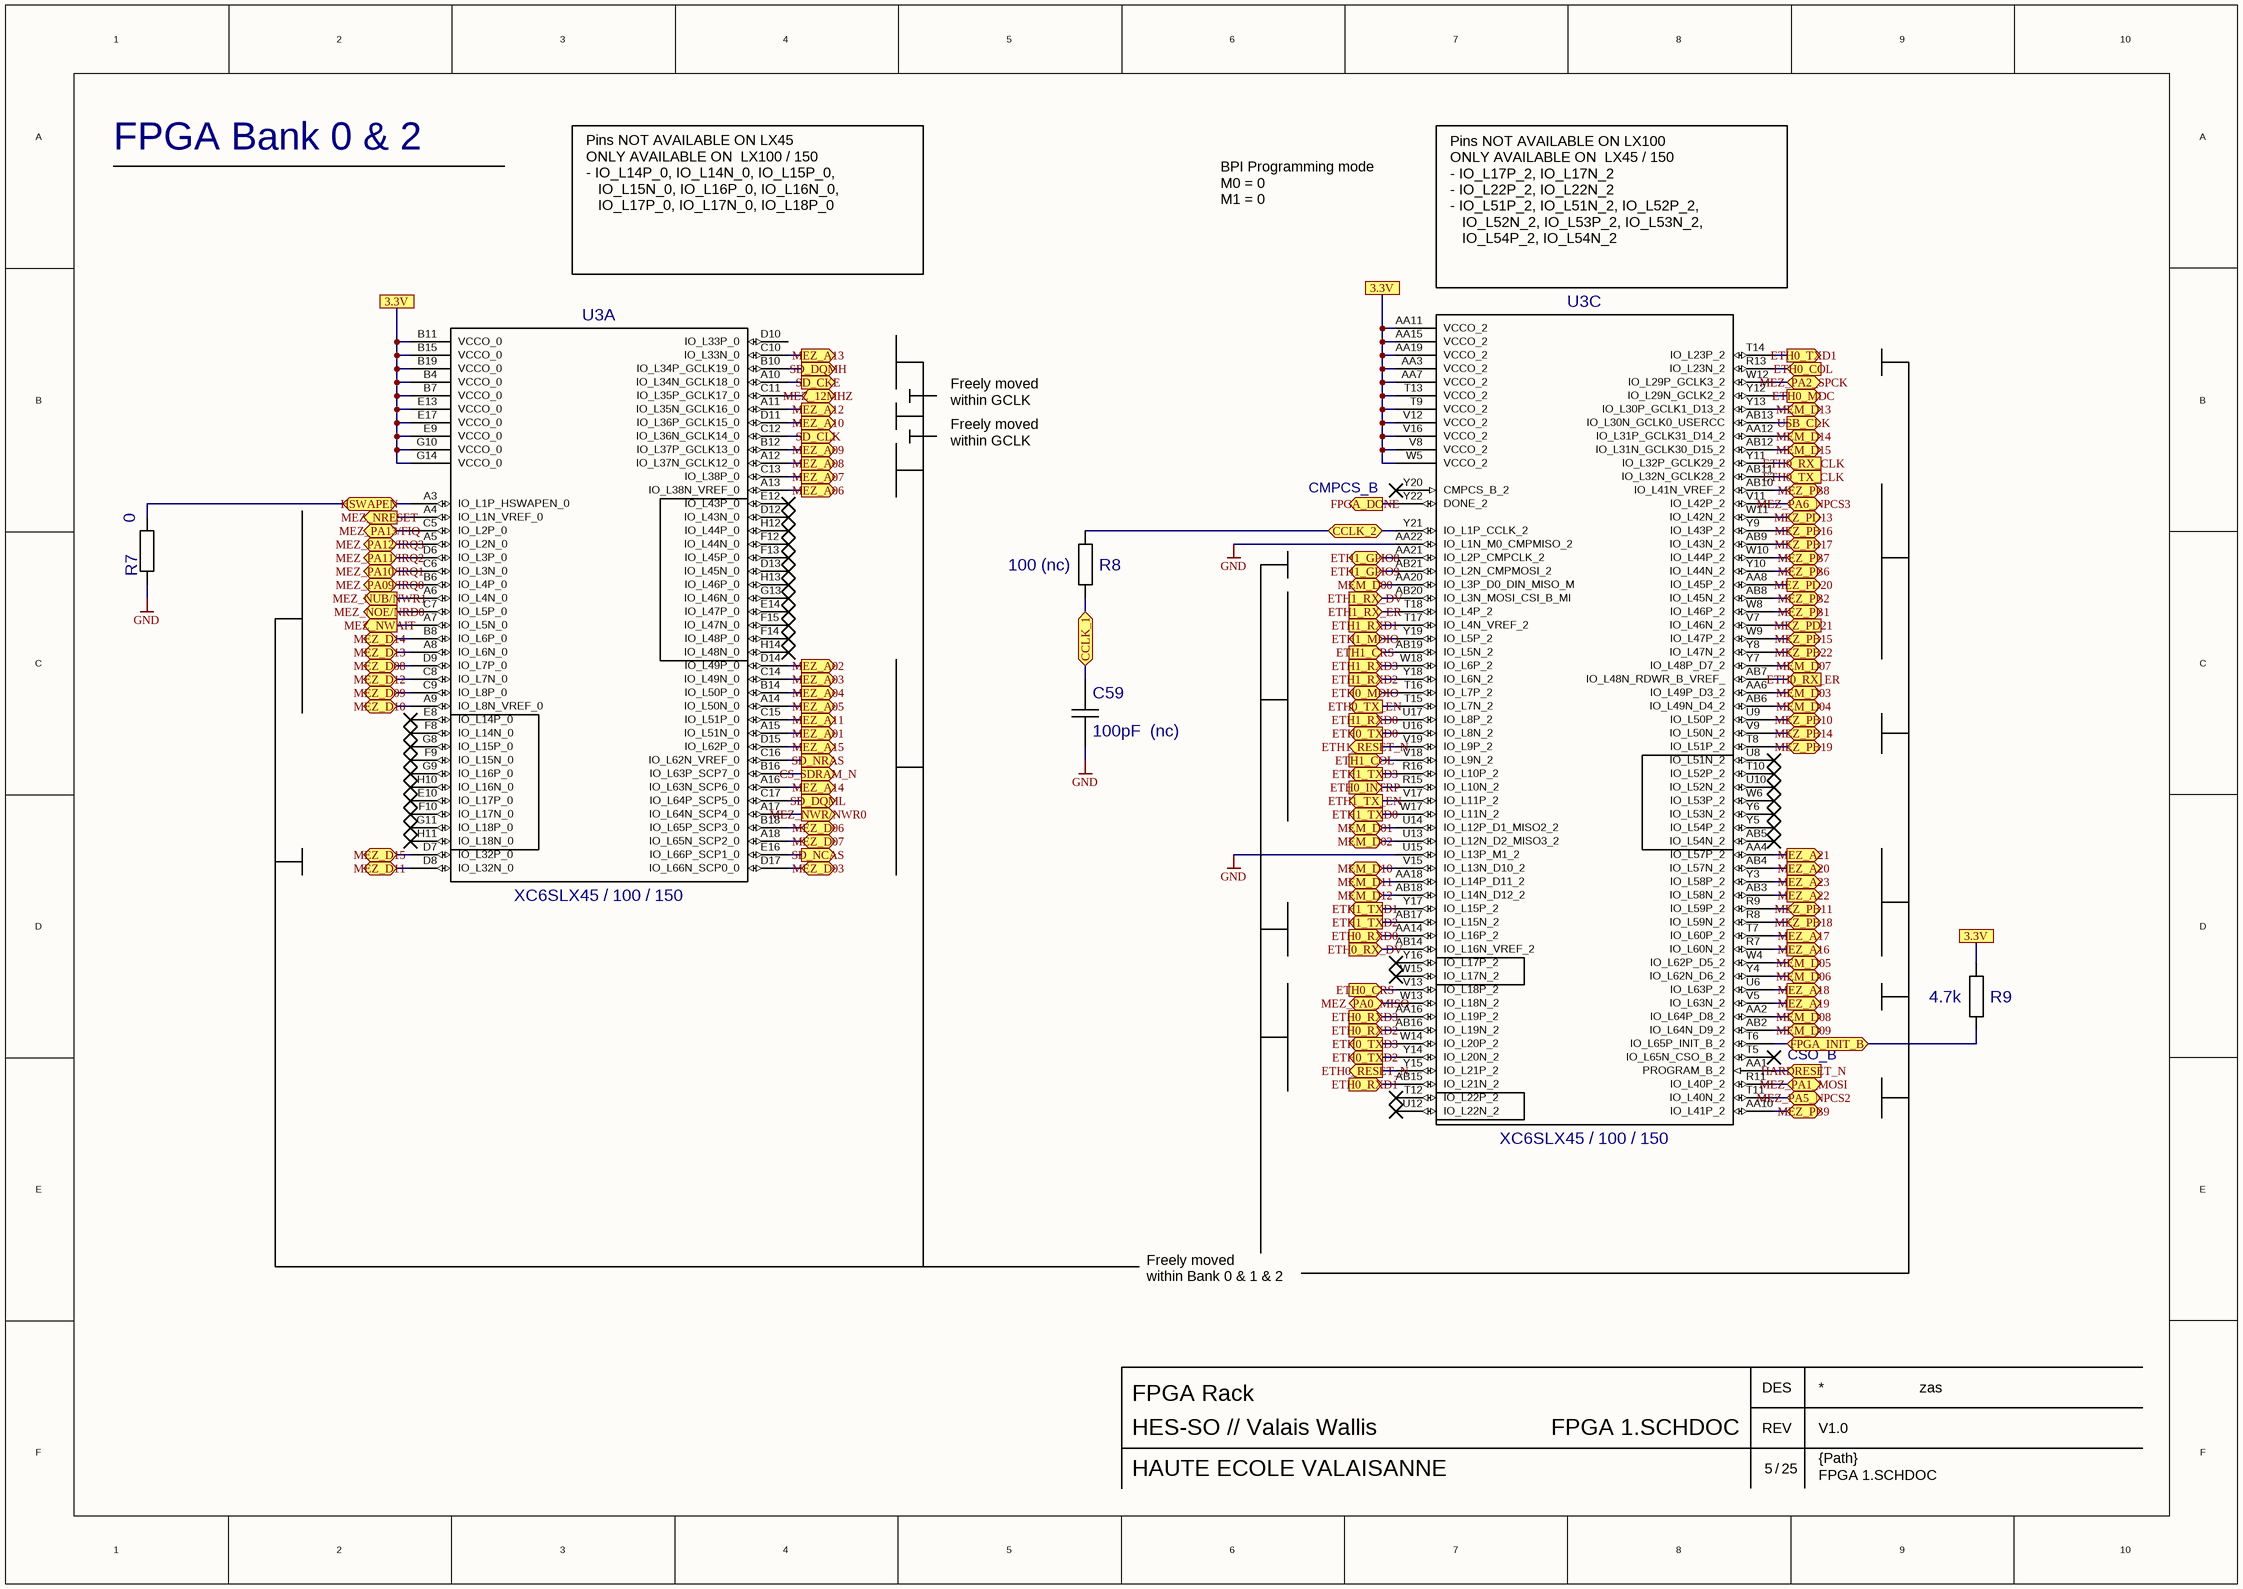
[diagram p5: FPGA 1.SCHDOC]

### Parts
C59  value 100pF  (nc)  [CC0805-MM]  (hidden comment: CAPS0805-MM)
R7  value 0  [RC0805-MM]  (hidden comment: RS0805-MM)
R8  value 100 (nc)  [RC0805-MM]  (hidden comment: RS0805-MM)
R9  value 4.7k  [RC0805-MM]  (hidden comment: RS0805-MM)
U3  value XC6SLX45 / 100 / 150  [BGA23X23-FG484]  (hidden comment: XC6SLX150 FGG484)  (parts A,C of 5)

### Ports
3.3V, CCLK_1 (bidir), CCLK_2 (bidir), CS_SDRAM_N (out), ETH0_COL (in), ETH0_CRS (in), ETH0_INTRP (in), ETH0_MDC (out), ETH0_MDIO (bidir), ETH0_RESET_N (out), ETH0_RX_CLK (in), ETH0_RX_DV (in), ETH0_RX_ER (in), ETH0_RXD0 (in), ETH0_RXD1 (in), ETH0_RXD2 (in), ETH0_RXD3 (in), ETH0_TX_CLK (in), ETH0_TX_EN (out), ETH0_TXD0 (out), ETH0_TXD1 (out), ETH0_TXD2 (out), ETH0_TXD3 (out), ETH1_COL (in), ETH1_CRS (in), ETH1_GPIO8 (bidir), ETH1_GPIO9 (bidir), ETH1_MDIO (bidir), ETH1_RESET_N (out), ETH1_RX_DV (in), ETH1_RX_ER (in), ETH1_RXD0 (in), ETH1_RXD1 (in), ETH1_RXD2 (in), ETH1_RXD3 (in), ETH1_TX_EN (out), ETH1_TXD0 (out), ETH1_TXD1 (out), ETH1_TXD2 (out), ETH1_TXD3 (out), FPGA_DONE (out), FPGA_INIT_B (bidir), HARDRESET_N (in), HSWAPEN (bidir), MEM_D00 (bidir), MEM_D01 (bidir), MEM_D02 (bidir), MEM_D03 (bidir), MEM_D04 (bidir), MEM_D05 (bidir), MEM_D06 (bidir), MEM_D07 (bidir), MEM_D08 (bidir), MEM_D09 (bidir), MEM_D10 (bidir), MEM_D11 (bidir), MEM_D12 (bidir), MEM_D13 (bidir), MEM_D14 (bidir), MEM_D15 (bidir), MEZ_12MHZ (bidir), MEZ_A01 (out), MEZ_A02 (out), MEZ_A03 (out), MEZ_A04 (out), MEZ_A05 (out), MEZ_A06 (out), MEZ_A07 (out), MEZ_A08 (out), MEZ_A09 (out), MEZ_A10 (out), MEZ_A11 (out), MEZ_A12 (out), MEZ_A13 (out), MEZ_A14 (out), MEZ_A15 (out), MEZ_A16 (out), MEZ_A17 (out), MEZ_A18 (out), MEZ_A19 (out), MEZ_A20 (out), MEZ_A21 (out), MEZ_A22 (out), MEZ_A23 (out), MEZ_D03 (bidir), MEZ_D06 (bidir), MEZ_D07 (bidir), MEZ_D08 (bidir), MEZ_D09 (bidir), MEZ_D10 (bidir), MEZ_D11 (bidir), MEZ_D12 (bidir), MEZ_D13 (bidir), MEZ_D14 (bidir), MEZ_D15 (bidir), MEZ_NOE/NRD0 (out), MEZ_NRESET (out), MEZ_NUB/NWR1 (out), MEZ_NWAIT (out), MEZ_NWR/NWR0 (out), MEZ_PA0_MISO (bidir), MEZ_PA1_MOSI (bidir), MEZ_PA2_SPCK (bidir), MEZ_PA5_NPCS2 (bidir), MEZ_PA6_NPCS3 (bidir), MEZ_PA09/IRQ0 (bidir), MEZ_PA10/IRQ1 (bidir), MEZ_PA11/IRQ2 (bidir), MEZ_PA12/IRQ3 (bidir), MEZ_PA13/FIQ (bidir), MEZ_PB1 (bidir), MEZ_PB2 (bidir), MEZ_PB6 (bidir), MEZ_PB7 (bidir), MEZ_PB8 (bidir), MEZ_PB9 (bidir), MEZ_PB10 (bidir), MEZ_PB11 (bidir), MEZ_PB14 (bidir), MEZ_PB15 (bidir), MEZ_PB16 (bidir), MEZ_PB17 (bidir), MEZ_PB18 (bidir), MEZ_PB19 (bidir), MEZ_PB22 (bidir), MEZ_PD13 (bidir), MEZ_PD20 (out), MEZ_PD21 (in), SD_CKE (out), SD_CLK (out), SD_DQMH (out), SD_DQML (out), SD_NCAS (out), SD_NRAS (out), USB_CLK (out)

### Nets
GND: C59.1 R7.1 U3.AA22(IO_L1N_M0_CMPMISO_2) U3.U15(IO_L13P_M1_2)
CCLK_1: C59.2 R8.1 ; port CCLK_1
CCLK_2: R8.2 U3.Y21(IO_L1P_CCLK_2) ; port CCLK_2
CS_SDRAM_N: U3.B16(IO_L63P_SCP7_0) ; port CS_SDRAM_N
ETH0_COL: U3.R13(IO_L23N_2) ; port ETH0_COL
ETH0_CRS: U3.V13(IO_L18P_2) ; port ETH0_CRS
ETH0_INTRP: U3.R15(IO_L10N_2) ; port ETH0_INTRP
ETH0_MDC: U3.Y12(IO_L29N_GCLK2_2) ; port ETH0_MDC
ETH0_MDIO: U3.T16(IO_L7P_2) ; port ETH0_MDIO
ETH0_RESET_N: U3.Y15(IO_L21P_2) ; port ETH0_RESET_N
ETH0_RX_CLK: U3.Y11(IO_L32P_GCLK29_2) ; port ETH0_RX_CLK
ETH0_RX_DV: U3.AB14(IO_L16N_VREF_2) ; port ETH0_RX_DV
ETH0_RX_ER: U3.AB7(IO_L48N_RDWR_B_VREF_) ; port ETH0_RX_ER
ETH0_RXD0: U3.AA14(IO_L16P_2) ; port ETH0_RXD0
ETH0_RXD1: U3.AB15(IO_L21N_2) ; port ETH0_RXD1
ETH0_RXD2: U3.AB16(IO_L19N_2) ; port ETH0_RXD2
ETH0_RXD3: U3.AA16(IO_L19P_2) ; port ETH0_RXD3
ETH0_TX_CLK: U3.AB11(IO_L32N_GCLK28_2) ; port ETH0_TX_CLK
ETH0_TX_EN: U3.T15(IO_L7N_2) ; port ETH0_TX_EN
ETH0_TXD0: U3.U16(IO_L8N_2) ; port ETH0_TXD0
ETH0_TXD1: U3.T14(IO_L23P_2) ; port ETH0_TXD1
ETH0_TXD2: U3.Y14(IO_L20N_2) ; port ETH0_TXD2
ETH0_TXD3: U3.W14(IO_L20P_2) ; port ETH0_TXD3
ETH1_COL: U3.V18(IO_L9N_2) ; port ETH1_COL
ETH1_CRS: U3.AB19(IO_L5N_2) ; port ETH1_CRS
ETH1_GPIO8: U3.AA21(IO_L2P_CMPCLK_2) ; port ETH1_GPIO8
ETH1_GPIO9: U3.AB21(IO_L2N_CMPMOSI_2) ; port ETH1_GPIO9
ETH1_MDIO: U3.Y19(IO_L5P_2) ; port ETH1_MDIO
ETH1_RESET_N: U3.V19(IO_L9P_2) ; port ETH1_RESET_N
ETH1_RX_DV: U3.AB20(IO_L3N_MOSI_CSI_B_MI) ; port ETH1_RX_DV
ETH1_RX_ER: U3.T18(IO_L4P_2) ; port ETH1_RX_ER
ETH1_RXD0: U3.U17(IO_L8P_2) ; port ETH1_RXD0
ETH1_RXD1: U3.T17(IO_L4N_VREF_2) ; port ETH1_RXD1
ETH1_RXD2: U3.Y18(IO_L6N_2) ; port ETH1_RXD2
ETH1_RXD3: U3.W18(IO_L6P_2) ; port ETH1_RXD3
ETH1_TX_EN: U3.V17(IO_L11P_2) ; port ETH1_TX_EN
ETH1_TXD0: U3.W17(IO_L11N_2) ; port ETH1_TXD0
ETH1_TXD1: U3.Y17(IO_L15P_2) ; port ETH1_TXD1
ETH1_TXD2: U3.AB17(IO_L15N_2) ; port ETH1_TXD2
ETH1_TXD3: U3.R16(IO_L10P_2) ; port ETH1_TXD3
FPGA_DONE: U3.Y22(DONE_2) ; port FPGA_DONE
FPGA_INIT_B: R9.2 U3.T6(IO_L65P_INIT_B_2) ; port FPGA_INIT_B
HARDRESET_N: U3.AA1(PROGRAM_B_2) ; port HARDRESET_N
HSWAPEN: R7.2 U3.A3(IO_L1P_HSWAPEN_0) ; port HSWAPEN
MEM_D00: U3.AA20(IO_L3P_D0_DIN_MISO_M) ; port MEM_D00
MEM_D01: U3.U14(IO_L12P_D1_MISO2_2) ; port MEM_D01
MEM_D02: U3.U13(IO_L12N_D2_MISO3_2) ; port MEM_D02
MEM_D03: U3.AA6(IO_L49P_D3_2) ; port MEM_D03
MEM_D04: U3.AB6(IO_L49N_D4_2) ; port MEM_D04
MEM_D05: U3.W4(IO_L62P_D5_2) ; port MEM_D05
MEM_D06: U3.Y4(IO_L62N_D6_2) ; port MEM_D06
MEM_D07: U3.Y7(IO_L48P_D7_2) ; port MEM_D07
MEM_D08: U3.AA2(IO_L64P_D8_2) ; port MEM_D08
MEM_D09: U3.AB2(IO_L64N_D9_2) ; port MEM_D09
MEM_D10: U3.V15(IO_L13N_D10_2) ; port MEM_D10
MEM_D11: U3.AA18(IO_L14P_D11_2) ; port MEM_D11
MEM_D12: U3.AB18(IO_L14N_D12_2) ; port MEM_D12
MEM_D13: U3.Y13(IO_L30P_GCLK1_D13_2) ; port MEM_D13
MEM_D14: U3.AA12(IO_L31P_GCLK31_D14_2) ; port MEM_D14
MEM_D15: U3.AB12(IO_L31N_GCLK30_D15_2) ; port MEM_D15
MEZ_12MHZ: U3.C11(IO_L35P_GCLK17_0) ; port MEZ_12MHZ
MEZ_A01: U3.A15(IO_L51N_0) ; port MEZ_A01
MEZ_A02: U3.D14(IO_L49P_0) ; port MEZ_A02
MEZ_A03: U3.C14(IO_L49N_0) ; port MEZ_A03
MEZ_A04: U3.B14(IO_L50P_0) ; port MEZ_A04
MEZ_A05: U3.A14(IO_L50N_0) ; port MEZ_A05
MEZ_A06: U3.A13(IO_L38N_VREF_0) ; port MEZ_A06
MEZ_A07: U3.C13(IO_L38P_0) ; port MEZ_A07
MEZ_A08: U3.A12(IO_L37N_GCLK12_0) ; port MEZ_A08
MEZ_A09: U3.B12(IO_L37P_GCLK13_0) ; port MEZ_A09
MEZ_A10: U3.D11(IO_L36P_GCLK15_0) ; port MEZ_A10
MEZ_A11: U3.C15(IO_L51P_0) ; port MEZ_A11
MEZ_A12: U3.A11(IO_L35N_GCLK16_0) ; port MEZ_A12
MEZ_A13: U3.C10(IO_L33N_0) ; port MEZ_A13
MEZ_A14: U3.A16(IO_L63N_SCP6_0) ; port MEZ_A14
MEZ_A15: U3.D15(IO_L62P_0) ; port MEZ_A15
MEZ_A16: U3.R7(IO_L60N_2) ; port MEZ_A16
MEZ_A17: U3.T7(IO_L60P_2) ; port MEZ_A17
MEZ_A18: U3.U6(IO_L63P_2) ; port MEZ_A18
MEZ_A19: U3.V5(IO_L63N_2) ; port MEZ_A19
MEZ_A20: U3.AB4(IO_L57N_2) ; port MEZ_A20
MEZ_A21: U3.AA4(IO_L57P_2) ; port MEZ_A21
MEZ_A22: U3.AB3(IO_L58N_2) ; port MEZ_A22
MEZ_A23: U3.Y3(IO_L58P_2) ; port MEZ_A23
MEZ_D03: U3.D17(IO_L66N_SCP0_0) ; port MEZ_D03
MEZ_D06: U3.B18(IO_L65P_SCP3_0) ; port MEZ_D06
MEZ_D07: U3.A18(IO_L65N_SCP2_0) ; port MEZ_D07
MEZ_D08: U3.D9(IO_L7P_0) ; port MEZ_D08
MEZ_D09: U3.C9(IO_L8P_0) ; port MEZ_D09
MEZ_D10: U3.A9(IO_L8N_VREF_0) ; port MEZ_D10
MEZ_D11: U3.D8(IO_L32N_0) ; port MEZ_D11
MEZ_D12: U3.C8(IO_L7N_0) ; port MEZ_D12
MEZ_D13: U3.A8(IO_L6N_0) ; port MEZ_D13
MEZ_D14: U3.B8(IO_L6P_0) ; port MEZ_D14
MEZ_D15: U3.D7(IO_L32P_0) ; port MEZ_D15
MEZ_NOE/NRD0: U3.C7(IO_L5P_0) ; port MEZ_NOE/NRD0
MEZ_NRESET: U3.A4(IO_L1N_VREF_0) ; port MEZ_NRESET
MEZ_NUB/NWR1: U3.A6(IO_L4N_0) ; port MEZ_NUB/NWR1
MEZ_NWAIT: U3.A7(IO_L5N_0) ; port MEZ_NWAIT
MEZ_NWR/NWR0: U3.A17(IO_L64N_SCP4_0) ; port MEZ_NWR/NWR0
MEZ_PA0_MISO: U3.W13(IO_L18N_2) ; port MEZ_PA0_MISO
MEZ_PA1_MOSI: U3.R11(IO_L40P_2) ; port MEZ_PA1_MOSI
MEZ_PA2_SPCK: U3.W12(IO_L29P_GCLK3_2) ; port MEZ_PA2_SPCK
MEZ_PA5_NPCS2: U3.T11(IO_L40N_2) ; port MEZ_PA5_NPCS2
MEZ_PA6_NPCS3: U3.V11(IO_L42P_2) ; port MEZ_PA6_NPCS3
MEZ_PA09/IRQ0: U3.B6(IO_L4P_0) ; port MEZ_PA09/IRQ0
MEZ_PA10/IRQ1: U3.C6(IO_L3N_0) ; port MEZ_PA10/IRQ1
MEZ_PA11/IRQ2: U3.D6(IO_L3P_0) ; port MEZ_PA11/IRQ2
MEZ_PA12/IRQ3: U3.A5(IO_L2N_0) ; port MEZ_PA12/IRQ3
MEZ_PA13/FIQ: U3.C5(IO_L2P_0) ; port MEZ_PA13/FIQ
MEZ_PB1: U3.W8(IO_L46P_2) ; port MEZ_PB1
MEZ_PB2: U3.AB8(IO_L45N_2) ; port MEZ_PB2
MEZ_PB6: U3.Y10(IO_L44N_2) ; port MEZ_PB6
MEZ_PB7: U3.W10(IO_L44P_2) ; port MEZ_PB7
MEZ_PB8: U3.AB10(IO_L41N_VREF_2) ; port MEZ_PB8
MEZ_PB9: U3.AA10(IO_L41P_2) ; port MEZ_PB9
MEZ_PB10: U3.U9(IO_L50P_2) ; port MEZ_PB10
MEZ_PB11: U3.R9(IO_L59P_2) ; port MEZ_PB11
MEZ_PB14: U3.V9(IO_L50N_2) ; port MEZ_PB14
MEZ_PB15: U3.W9(IO_L47P_2) ; port MEZ_PB15
MEZ_PB16: U3.Y9(IO_L43P_2) ; port MEZ_PB16
MEZ_PB17: U3.AB9(IO_L43N_2) ; port MEZ_PB17
MEZ_PB18: U3.R8(IO_L59N_2) ; port MEZ_PB18
MEZ_PB19: U3.T8(IO_L51P_2) ; port MEZ_PB19
MEZ_PB22: U3.Y8(IO_L47N_2) ; port MEZ_PB22
MEZ_PD13: U3.W11(IO_L42N_2) ; port MEZ_PD13
MEZ_PD20: U3.AA8(IO_L45P_2) ; port MEZ_PD20
MEZ_PD21: U3.V7(IO_L46N_2) ; port MEZ_PD21
SD_CKE: U3.A10(IO_L34N_GCLK18_0) ; port SD_CKE
SD_CLK: U3.C12(IO_L36N_GCLK14_0) ; port SD_CLK
SD_DQMH: U3.B10(IO_L34P_GCLK19_0) ; port SD_DQMH
SD_DQML: U3.C17(IO_L64P_SCP5_0) ; port SD_DQML
SD_NCAS: U3.E16(IO_L66P_SCP1_0) ; port SD_NCAS
SD_NRAS: U3.C16(IO_L62N_VREF_0) ; port SD_NRAS
USB_CLK: U3.AB13(IO_L30N_GCLK0_USERCC) ; port USB_CLK
NetU3_AA3: U3.AA3(VCCO_2) U3.AA7(VCCO_2) U3.AA11(VCCO_2) U3.AA15(VCCO_2) U3.AA19(VCCO_2) U3.T9(VCCO_2) U3.T13(VCCO_2) U3.V8(VCCO_2) U3.V12(VCCO_2) U3.V16(VCCO_2) U3.W5(VCCO_2)
NetU3_B4: U3.B4(VCCO_0) U3.B7(VCCO_0) U3.B11(VCCO_0) U3.B15(VCCO_0) U3.B19(VCCO_0) U3.E9(VCCO_0) U3.E13(VCCO_0) U3.E17(VCCO_0) U3.G10(VCCO_0) U3.G14(VCCO_0)

Not connected (* = marked no-connect by the designer): R9 1; U3 AB5(IO_L54N_2) D10(IO_L33P_0) D12(IO_L43N_0) D13(IO_L45N_0) E8(IO_L14P_0) E10(IO_L17P_0) E12(IO_L43P_0) E14(IO_L47P_0) F8(IO_L14N_0) F9(IO_L15N_0) F10(IO_L17N_0) F12(IO_L44N_0) F13(IO_L45P_0) F14(IO_L48P_0) F15(IO_L47N_0) G8(IO_L15P_0) G9(IO_L16P_0) G11(IO_L18P_0) G13(IO_L46N_0) H10(IO_L16N_0) H11(IO_L18N_0) H12(IO_L44P_0) H13(IO_L46P_0) H14(IO_L48N_0) T5(IO_L65N_CSO_B_2) T10(IO_L52P_2) T12(IO_L22P_2) U8(IO_L51N_2) U10(IO_L52N_2) U12(IO_L22N_2) W6(IO_L53P_2) W15(IO_L17N_2) Y5(IO_L54P_2) Y6(IO_L53N_2) Y16(IO_L17P_2) Y20(CMPCS_B_2)

### Notes on the sheet
- FPGA Bank 0 & 2
- Pins NOT AVAILABLE ON LX45
  ONLY AVAILABLE ON  LX100 / 150
  - IO_L14P_0, IO_L14N_0, IO_L15P_0,
  IO_L15N_0, IO_L16P_0, IO_L16N_0,
  IO_L17P_0, IO_L17N_0, IO_L18P_0
- BPI Programming mode
  M0 = 0
  M1 = 0
- (near U3) Pins NOT AVAILABLE ON LX100
  ONLY AVAILABLE ON  LX45 / 150
  - IO_L17P_2, IO_L17N_2
  - IO_L22P_2, IO_L22N_2
  - IO_L51P_2, IO_L51N_2, IO_L52P_2,
  IO_L52N_2, IO_L53P_2, IO_L53N_2,
  IO_L54P_2, IO_L54N_2
- Freely moved
  within GCLK
- CMPCS_B
- CSO_B
- Freely moved
  within Bank 0 & 1 & 2
- DES
- HES-SO // Valais Wallis
- HAUTE ECOLE VALAISANNE
- /
- REV
- {Path}

### Library data of the parts
C59 = CAPS0805-MM: Capacitor
R7 = RS0805-MM: Partition: FPGA Config; RefDes2: {RefDes2}; MEZZAONLY: YES

## Sheet FPGA 2.SCHDOC: FPGA Rack
size 420 x 297 mm; DrawnBy: zas; Revision: V1.0; SheetNumber: 6; SheetTotal: 25; DocumentName: FPGA 2.SCHDOC
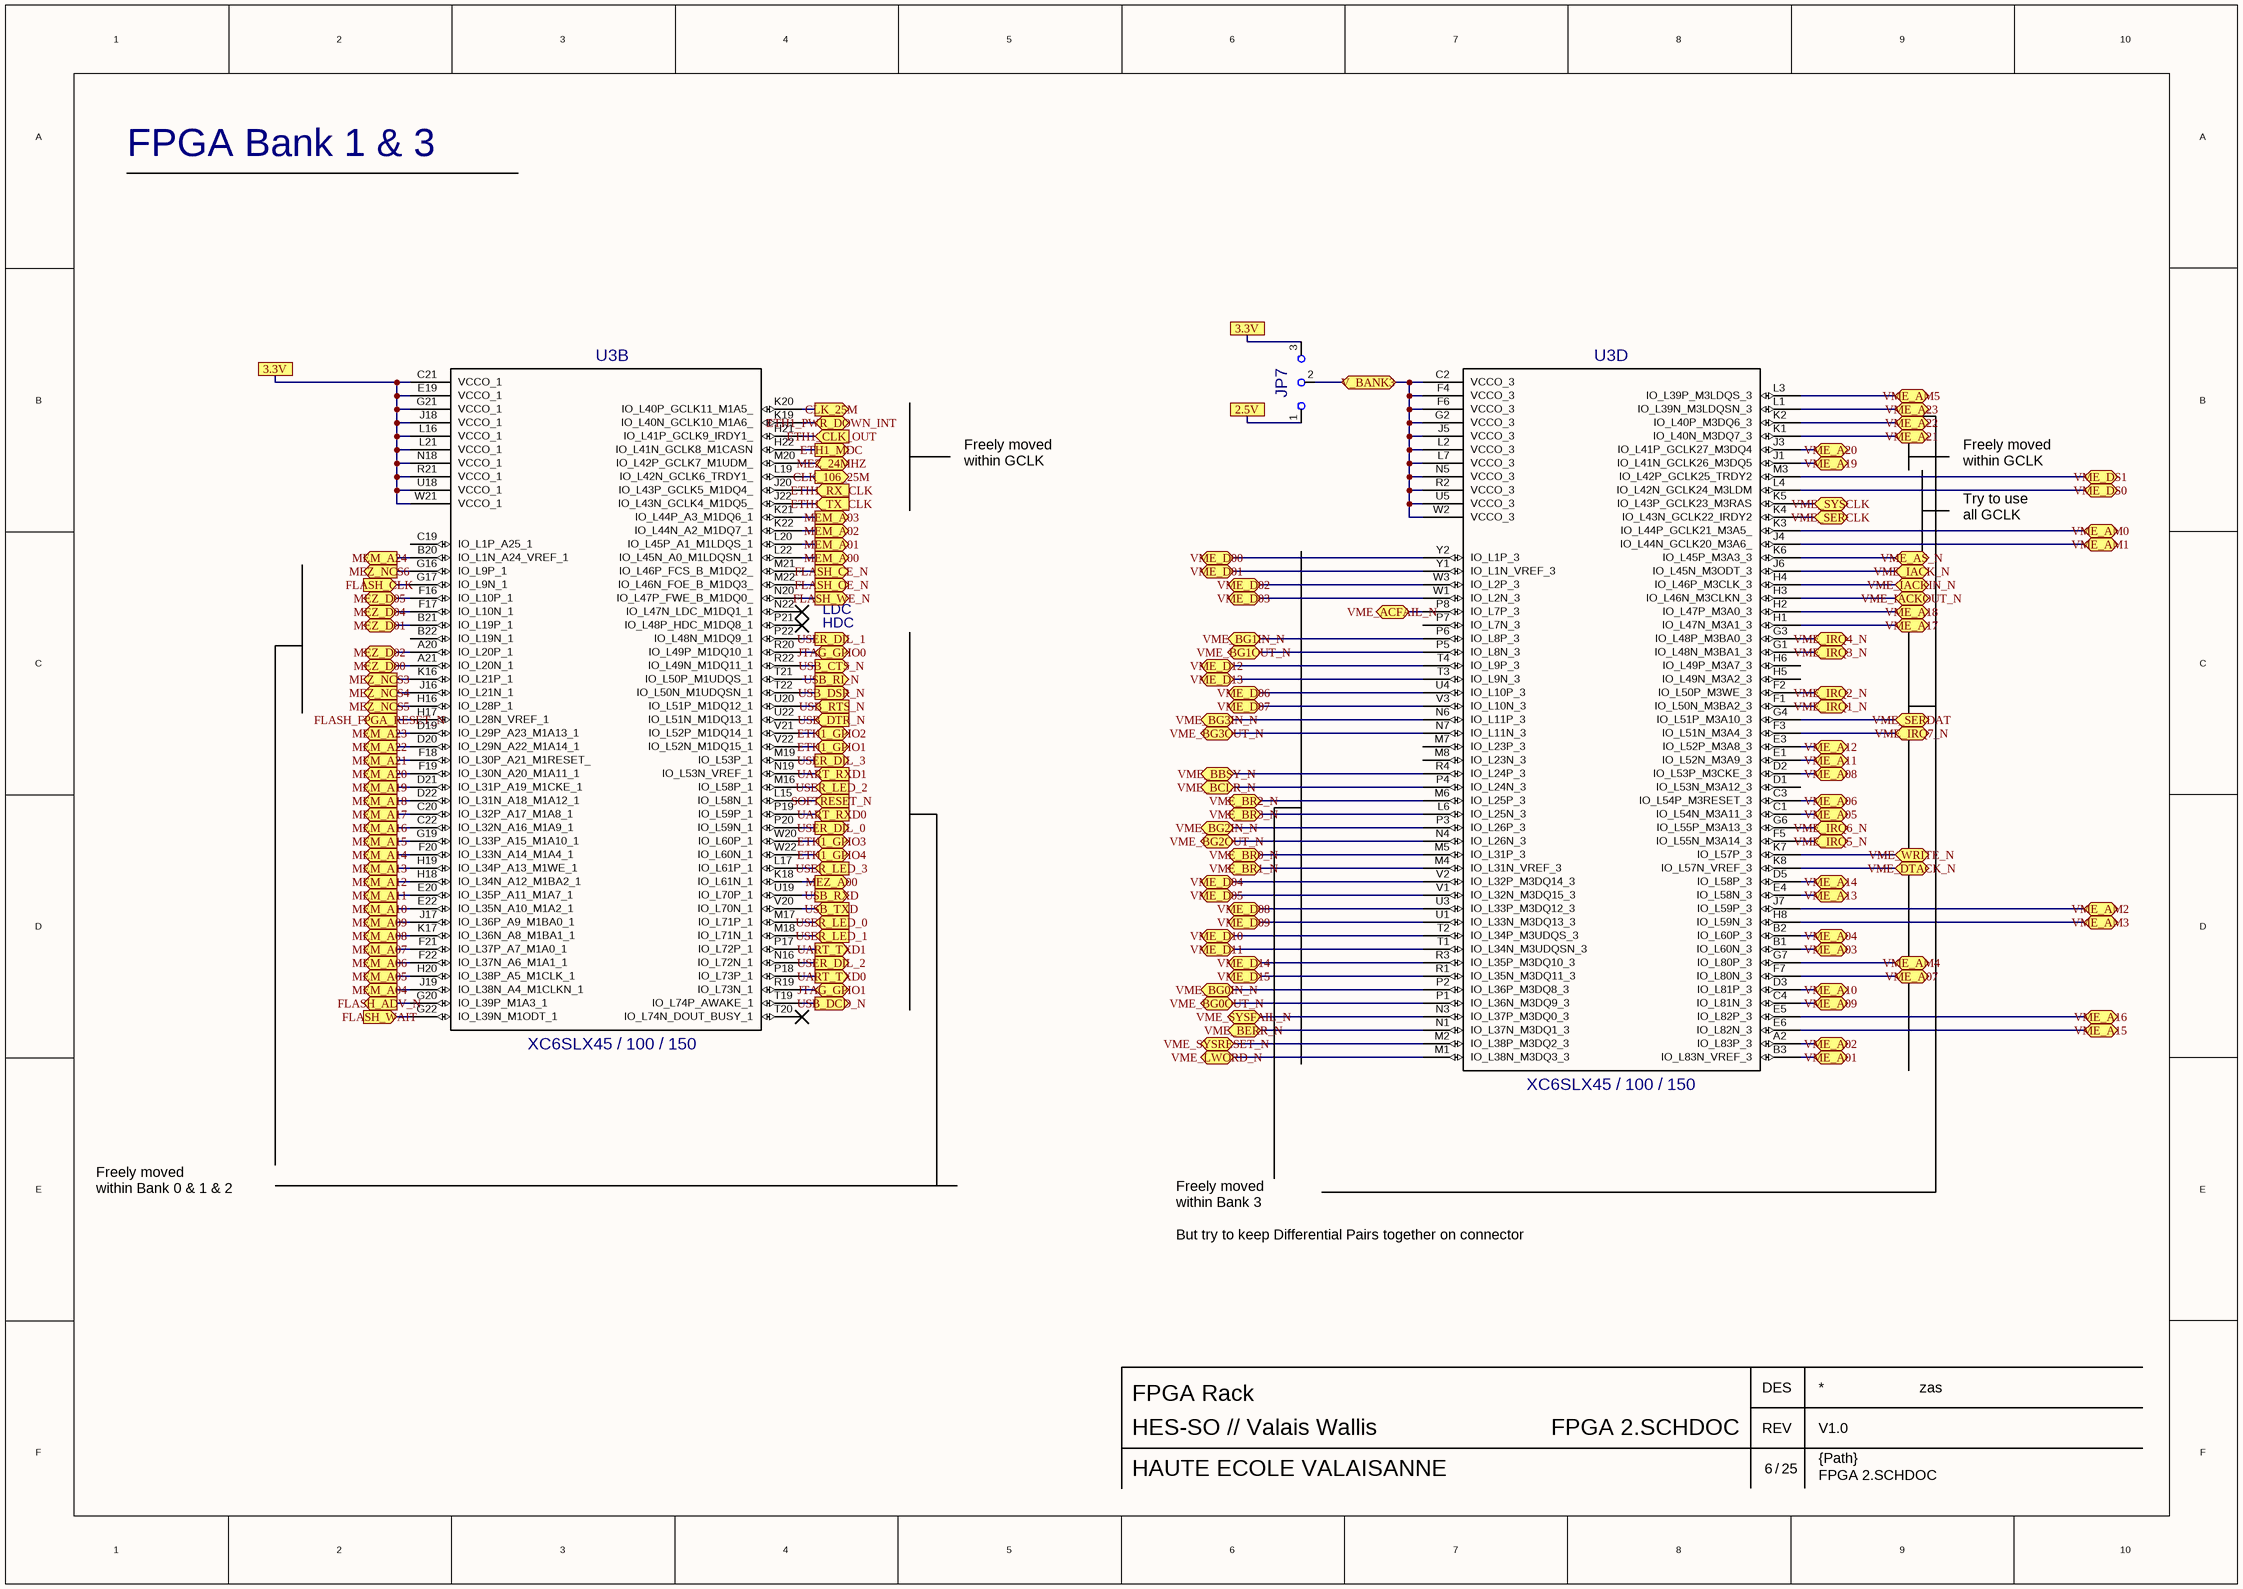
[diagram p6: FPGA 2.SCHDOC]

### Parts
JP7  JUMPER-SMD3  [JUMPER-SMD3]  (value not drawn)
U3  value XC6SLX45 / 100 / 150  [BGA23X23-FG484]  (hidden comment: XC6SLX150 FGG484)  (parts B,D of 5)

### Ports
2.5V, 3.3V, CLK_25M (out), CLK_106_25M (out), ETH1_CLK_OUT (in), ETH1_GPIO1 (bidir), ETH1_GPIO2 (bidir), ETH1_GPIO3 (bidir), ETH1_GPIO4 (bidir), ETH1_MDC (out), ETH1_PWR_DOWN_INT (bidir), ETH1_RX_CLK (in), ETH1_TX_CLK (in), FLASH_ADV_N (out), FLASH_CE_N (out), FLASH_CLK (in), FLASH_FPGA_RESET_N (out), FLASH_OE_N (out), FLASH_WAIT (in), FLASH_WE_N (out), JTAG_GPIO0 (bidir), JTAG_GPIO1 (bidir), MEM_A00 (out), MEM_A01 (out), MEM_A02 (out), MEM_A03 (out), MEM_A04 (out), MEM_A05 (out), MEM_A06 (out), MEM_A07 (out), MEM_A08 (out), MEM_A09 (out), MEM_A10 (out), MEM_A11 (out), MEM_A12 (out), MEM_A13 (out), MEM_A14 (out), MEM_A15 (out), MEM_A16 (out), MEM_A17 (out), MEM_A18 (out), MEM_A19 (out), MEM_A20 (out), MEM_A21 (out), MEM_A22 (out), MEM_A23 (out), MEM_A24 (out), MEZ_24MHZ (bidir), MEZ_A00 (out), MEZ_D00 (bidir), MEZ_D01 (bidir), MEZ_D02 (bidir), MEZ_D04 (bidir), MEZ_D05 (bidir), MEZ_NCS3 (out), MEZ_NCS4 (out), MEZ_NCS5 (out), MEZ_NCS6 (out), SOFTRESET_N (in), UART_RXD0 (in), UART_RXD1 (in), UART_TXD0 (out), UART_TXD1 (out), USB_CTS_N (out), USB_DCD_N (out), USB_DSR_N (out), USB_DTR_N (in), USB_RI_N (out), USB_RTS_N (in), USB_RXD (out), USB_TXD (in), USER_DIL_0 (out), USER_DIL_1 (out), USER_DIL_2 (out), USER_DIL_3 (out), USER_LED_0 (in), USER_LED_1 (in), USER_LED_2 (in), USER_LED_3 (in), V_BANK3 (bidir), VME_A01 (bidir), VME_A02 (bidir), VME_A03 (bidir), VME_A04 (bidir), VME_A05 (bidir), VME_A06 (bidir), VME_A07 (bidir), VME_A08 (bidir), VME_A09 (bidir), VME_A10 (bidir), VME_A11 (bidir), VME_A12 (bidir), VME_A13 (bidir), VME_A14 (bidir), VME_A15 (bidir), VME_A16 (bidir), VME_A17 (bidir), VME_A18 (bidir), VME_A19 (bidir), VME_A20 (bidir), VME_A21 (bidir), VME_A22 (bidir), VME_A23 (bidir), VME_ACFAIL_N (bidir), VME_AM0 (bidir), VME_AM1 (bidir), VME_AM2 (bidir), VME_AM3 (bidir), VME_AM4 (bidir), VME_AM5 (bidir), VME_AS_N (bidir), VME_BBSY_N (bidir), VME_BCLR_N (bidir), VME_BERR_N (bidir), VME_BG0IN_N (bidir), VME_BG0OUT_N (bidir), VME_BG1IN_N (bidir), VME_BG1OUT_N (bidir), VME_BG2IN_N (bidir), VME_BG2OUT_N (bidir), VME_BG3IN_N (bidir), VME_BG3OUT_N (bidir), VME_BR0_N (bidir), VME_BR1_N (bidir), VME_BR2_N (bidir), VME_BR3_N (bidir), VME_D00 (bidir), VME_D01 (bidir), VME_D02 (bidir), VME_D03 (bidir), VME_D04 (bidir), VME_D05 (bidir), VME_D06 (bidir), VME_D07 (bidir), VME_D08 (bidir), VME_D09 (bidir), VME_D10 (bidir), VME_D11 (bidir), VME_D12 (bidir), VME_D13 (bidir), VME_D14 (bidir), VME_D15 (bidir), VME_DS0 (bidir), VME_DS1 (bidir), VME_DTACK_N (bidir), VME_IACK_N (bidir), VME_IACKIN_N (bidir), VME_IACKOUT_N (bidir), VME_IRQ1_N (bidir), VME_IRQ2_N (bidir), VME_IRQ3_N (bidir), VME_IRQ4_N (bidir), VME_IRQ5_N (bidir), VME_IRQ6_N (bidir), VME_IRQ7_N (bidir), VME_LWORD_N (bidir), VME_SERCLK (bidir), VME_SERDAT (bidir), VME_SYSCLK (bidir), VME_SYSFAIL_N (bidir), VME_SYSRESET_N (bidir), VME_WRITE_N (bidir)

### Nets
CLK_25M: U3.K20(IO_L40P_GCLK11_M1A5_) ; port CLK_25M
CLK_106_25M: U3.L19(IO_L42N_GCLK6_TRDY1_) ; port CLK_106_25M
ETH1_CLK_OUT: U3.H21(IO_L41P_GCLK9_IRDY1_) ; port ETH1_CLK_OUT
ETH1_GPIO1: U3.V22(IO_L52N_M1DQ15_1) ; port ETH1_GPIO1
ETH1_GPIO2: U3.V21(IO_L52P_M1DQ14_1) ; port ETH1_GPIO2
ETH1_GPIO3: U3.W20(IO_L60P_1) ; port ETH1_GPIO3
ETH1_GPIO4: U3.W22(IO_L60N_1) ; port ETH1_GPIO4
ETH1_MDC: U3.H22(IO_L41N_GCLK8_M1CASN) ; port ETH1_MDC
ETH1_PWR_DOWN_INT: U3.K19(IO_L40N_GCLK10_M1A6_) ; port ETH1_PWR_DOWN_INT
ETH1_RX_CLK: U3.J20(IO_L43P_GCLK5_M1DQ4_) ; port ETH1_RX_CLK
ETH1_TX_CLK: U3.J22(IO_L43N_GCLK4_M1DQ5_) ; port ETH1_TX_CLK
FLASH_ADV_N: U3.G20(IO_L39P_M1A3_1) ; port FLASH_ADV_N
FLASH_CE_N: U3.M21(IO_L46P_FCS_B_M1DQ2_) ; port FLASH_CE_N
FLASH_CLK: U3.G17(IO_L9N_1) ; port FLASH_CLK
FLASH_FPGA_RESET_N: U3.H17(IO_L28N_VREF_1) ; port FLASH_FPGA_RESET_N
FLASH_OE_N: U3.M22(IO_L46N_FOE_B_M1DQ3_) ; port FLASH_OE_N
FLASH_WAIT: U3.G22(IO_L39N_M1ODT_1) ; port FLASH_WAIT
FLASH_WE_N: U3.N20(IO_L47P_FWE_B_M1DQ0_) ; port FLASH_WE_N
JTAG_GPIO0: U3.R20(IO_L49P_M1DQ10_1) ; port JTAG_GPIO0
JTAG_GPIO1: U3.R19(IO_L73N_1) ; port JTAG_GPIO1
MEM_A00: U3.L22(IO_L45N_A0_M1LDQSN_1) ; port MEM_A00
MEM_A01: U3.L20(IO_L45P_A1_M1LDQS_1) ; port MEM_A01
MEM_A02: U3.K22(IO_L44N_A2_M1DQ7_1) ; port MEM_A02
MEM_A03: U3.K21(IO_L44P_A3_M1DQ6_1) ; port MEM_A03
MEM_A04: U3.J19(IO_L38N_A4_M1CLKN_1) ; port MEM_A04
MEM_A05: U3.H20(IO_L38P_A5_M1CLK_1) ; port MEM_A05
MEM_A06: U3.F22(IO_L37N_A6_M1A1_1) ; port MEM_A06
MEM_A07: U3.F21(IO_L37P_A7_M1A0_1) ; port MEM_A07
MEM_A08: U3.K17(IO_L36N_A8_M1BA1_1) ; port MEM_A08
MEM_A09: U3.J17(IO_L36P_A9_M1BA0_1) ; port MEM_A09
MEM_A10: U3.E22(IO_L35N_A10_M1A2_1) ; port MEM_A10
MEM_A11: U3.E20(IO_L35P_A11_M1A7_1) ; port MEM_A11
MEM_A12: U3.H18(IO_L34N_A12_M1BA2_1) ; port MEM_A12
MEM_A13: U3.H19(IO_L34P_A13_M1WE_1) ; port MEM_A13
MEM_A14: U3.F20(IO_L33N_A14_M1A4_1) ; port MEM_A14
MEM_A15: U3.G19(IO_L33P_A15_M1A10_1) ; port MEM_A15
MEM_A16: U3.C22(IO_L32N_A16_M1A9_1) ; port MEM_A16
MEM_A17: U3.C20(IO_L32P_A17_M1A8_1) ; port MEM_A17
MEM_A18: U3.D22(IO_L31N_A18_M1A12_1) ; port MEM_A18
MEM_A19: U3.D21(IO_L31P_A19_M1CKE_1) ; port MEM_A19
MEM_A20: U3.F19(IO_L30N_A20_M1A11_1) ; port MEM_A20
MEM_A21: U3.F18(IO_L30P_A21_M1RESET_) ; port MEM_A21
MEM_A22: U3.D20(IO_L29N_A22_M1A14_1) ; port MEM_A22
MEM_A23: U3.D19(IO_L29P_A23_M1A13_1) ; port MEM_A23
MEM_A24: U3.B20(IO_L1N_A24_VREF_1) ; port MEM_A24
MEZ_24MHZ: U3.M20(IO_L42P_GCLK7_M1UDM_) ; port MEZ_24MHZ
MEZ_A00: U3.K18(IO_L61N_1) ; port MEZ_A00
MEZ_D00: U3.A21(IO_L20N_1) ; port MEZ_D00
MEZ_D01: U3.B21(IO_L19P_1) ; port MEZ_D01
MEZ_D02: U3.A20(IO_L20P_1) ; port MEZ_D02
MEZ_D04: U3.F17(IO_L10N_1) ; port MEZ_D04
MEZ_D05: U3.F16(IO_L10P_1) ; port MEZ_D05
MEZ_NCS3: U3.K16(IO_L21P_1) ; port MEZ_NCS3
MEZ_NCS4: U3.J16(IO_L21N_1) ; port MEZ_NCS4
MEZ_NCS5: U3.H16(IO_L28P_1) ; port MEZ_NCS5
MEZ_NCS6: U3.G16(IO_L9P_1) ; port MEZ_NCS6
SOFTRESET_N: U3.L15(IO_L58N_1) ; port SOFTRESET_N
UART_RXD0: U3.P19(IO_L59P_1) ; port UART_RXD0
UART_RXD1: U3.N19(IO_L53N_VREF_1) ; port UART_RXD1
UART_TXD0: U3.P18(IO_L73P_1) ; port UART_TXD0
UART_TXD1: U3.P17(IO_L72P_1) ; port UART_TXD1
USB_CTS_N: U3.R22(IO_L49N_M1DQ11_1) ; port USB_CTS_N
USB_DCD_N: U3.T19(IO_L74P_AWAKE_1) ; port USB_DCD_N
USB_DSR_N: U3.T22(IO_L50N_M1UDQSN_1) ; port USB_DSR_N
USB_DTR_N: U3.U22(IO_L51N_M1DQ13_1) ; port USB_DTR_N
USB_RI_N: U3.T21(IO_L50P_M1UDQS_1) ; port USB_RI_N
USB_RTS_N: U3.U20(IO_L51P_M1DQ12_1) ; port USB_RTS_N
USB_RXD: U3.U19(IO_L70P_1) ; port USB_RXD
USB_TXD: U3.V20(IO_L70N_1) ; port USB_TXD
USER_DIL_0: U3.P20(IO_L59N_1) ; port USER_DIL_0
USER_DIL_1: U3.P22(IO_L48N_M1DQ9_1) ; port USER_DIL_1
USER_DIL_2: U3.N16(IO_L72N_1) ; port USER_DIL_2
USER_DIL_3: U3.M19(IO_L53P_1) ; port USER_DIL_3
USER_LED_0: U3.M17(IO_L71P_1) ; port USER_LED_0
USER_LED_1: U3.M18(IO_L71N_1) ; port USER_LED_1
USER_LED_2: U3.M16(IO_L58P_1) ; port USER_LED_2
USER_LED_3: U3.L17(IO_L61P_1) ; port USER_LED_3
V_BANK3: JP7.2 U3.C2(VCCO_3) U3.F4(VCCO_3) U3.F6(VCCO_3) U3.G2(VCCO_3) U3.J5(VCCO_3) U3.L2(VCCO_3) U3.L7(VCCO_3) U3.N5(VCCO_3) U3.R2(VCCO_3) U3.U5(VCCO_3) U3.W2(VCCO_3) ; port V_BANK3
VME_A01: U3.B3(IO_L83N_VREF_3) ; port VME_A01
VME_A02: U3.A2(IO_L83P_3) ; port VME_A02
VME_A03: U3.B1(IO_L60N_3) ; port VME_A03
VME_A04: U3.B2(IO_L60P_3) ; port VME_A04
VME_A05: U3.C1(IO_L54N_M3A11_3) ; port VME_A05
VME_A06: U3.C3(IO_L54P_M3RESET_3) ; port VME_A06
VME_A07: U3.F7(IO_L80N_3) ; port VME_A07
VME_A08: U3.D2(IO_L53P_M3CKE_3) ; port VME_A08
VME_A09: U3.C4(IO_L81N_3) ; port VME_A09
VME_A10: U3.D3(IO_L81P_3) ; port VME_A10
VME_A11: U3.E1(IO_L52N_M3A9_3) ; port VME_A11
VME_A12: U3.E3(IO_L52P_M3A8_3) ; port VME_A12
VME_A13: U3.E4(IO_L58N_3) ; port VME_A13
VME_A14: U3.D5(IO_L58P_3) ; port VME_A14
VME_A15: U3.E6(IO_L82N_3) ; port VME_A15
VME_A16: U3.E5(IO_L82P_3) ; port VME_A16
VME_A17: U3.H1(IO_L47N_M3A1_3) ; port VME_A17
VME_A18: U3.H2(IO_L47P_M3A0_3) ; port VME_A18
VME_A19: U3.J1(IO_L41N_GCLK26_M3DQ5) ; port VME_A19
VME_A20: U3.J3(IO_L41P_GCLK27_M3DQ4) ; port VME_A20
VME_A21: U3.K1(IO_L40N_M3DQ7_3) ; port VME_A21
VME_A22: U3.K2(IO_L40P_M3DQ6_3) ; port VME_A22
VME_A23: U3.L1(IO_L39N_M3LDQSN_3) ; port VME_A23
VME_ACFAIL_N: U3.P8(IO_L7P_3) ; port VME_ACFAIL_N
VME_AM0: U3.K3(IO_L44P_GCLK21_M3A5_) ; port VME_AM0
VME_AM1: U3.J4(IO_L44N_GCLK20_M3A6_) ; port VME_AM1
VME_AM2: U3.J7(IO_L59P_3) ; port VME_AM2
VME_AM3: U3.H8(IO_L59N_3) ; port VME_AM3
VME_AM4: U3.G7(IO_L80P_3) ; port VME_AM4
VME_AM5: U3.L3(IO_L39P_M3LDQS_3) ; port VME_AM5
VME_AS_N: U3.K6(IO_L45P_M3A3_3) ; port VME_AS_N
VME_BBSY_N: U3.R4(IO_L24P_3) ; port VME_BBSY_N
VME_BCLR_N: U3.P4(IO_L24N_3) ; port VME_BCLR_N
VME_BERR_N: U3.N1(IO_L37N_M3DQ1_3) ; port VME_BERR_N
VME_BG0IN_N: U3.P2(IO_L36P_M3DQ8_3) ; port VME_BG0IN_N
VME_BG0OUT_N: U3.P1(IO_L36N_M3DQ9_3) ; port VME_BG0OUT_N
VME_BG1IN_N: U3.P6(IO_L8P_3) ; port VME_BG1IN_N
VME_BG1OUT_N: U3.P5(IO_L8N_3) ; port VME_BG1OUT_N
VME_BG2IN_N: U3.P3(IO_L26P_3) ; port VME_BG2IN_N
VME_BG2OUT_N: U3.N4(IO_L26N_3) ; port VME_BG2OUT_N
VME_BG3IN_N: U3.N6(IO_L11P_3) ; port VME_BG3IN_N
VME_BG3OUT_N: U3.N7(IO_L11N_3) ; port VME_BG3OUT_N
VME_BR0_N: U3.M5(IO_L31P_3) ; port VME_BR0_N
VME_BR1_N: U3.M4(IO_L31N_VREF_3) ; port VME_BR1_N
VME_BR2_N: U3.M6(IO_L25P_3) ; port VME_BR2_N
VME_BR3_N: U3.L6(IO_L25N_3) ; port VME_BR3_N
VME_D00: U3.Y2(IO_L1P_3) ; port VME_D00
VME_D01: U3.Y1(IO_L1N_VREF_3) ; port VME_D01
VME_D02: U3.W3(IO_L2P_3) ; port VME_D02
VME_D03: U3.W1(IO_L2N_3) ; port VME_D03
VME_D04: U3.V2(IO_L32P_M3DQ14_3) ; port VME_D04
VME_D05: U3.V1(IO_L32N_M3DQ15_3) ; port VME_D05
VME_D06: U3.U4(IO_L10P_3) ; port VME_D06
VME_D07: U3.V3(IO_L10N_3) ; port VME_D07
VME_D08: U3.U3(IO_L33P_M3DQ12_3) ; port VME_D08
VME_D09: U3.U1(IO_L33N_M3DQ13_3) ; port VME_D09
VME_D10: U3.T2(IO_L34P_M3UDQS_3) ; port VME_D10
VME_D11: U3.T1(IO_L34N_M3UDQSN_3) ; port VME_D11
VME_D12: U3.T4(IO_L9P_3) ; port VME_D12
VME_D13: U3.T3(IO_L9N_3) ; port VME_D13
VME_D14: U3.R3(IO_L35P_M3DQ10_3) ; port VME_D14
VME_D15: U3.R1(IO_L35N_M3DQ11_3) ; port VME_D15
VME_DS0: U3.L4(IO_L42N_GCLK24_M3LDM) ; port VME_DS0
VME_DS1: U3.M3(IO_L42P_GCLK25_TRDY2) ; port VME_DS1
VME_DTACK_N: U3.K8(IO_L57N_VREF_3) ; port VME_DTACK_N
VME_IACK_N: U3.J6(IO_L45N_M3ODT_3) ; port VME_IACK_N
VME_IACKIN_N: U3.H4(IO_L46P_M3CLK_3) ; port VME_IACKIN_N
VME_IACKOUT_N: U3.H3(IO_L46N_M3CLKN_3) ; port VME_IACKOUT_N
VME_IRQ1_N: U3.F1(IO_L50N_M3BA2_3) ; port VME_IRQ1_N
VME_IRQ2_N: U3.F2(IO_L50P_M3WE_3) ; port VME_IRQ2_N
VME_IRQ3_N: U3.G1(IO_L48N_M3BA1_3) ; port VME_IRQ3_N
VME_IRQ4_N: U3.G3(IO_L48P_M3BA0_3) ; port VME_IRQ4_N
VME_IRQ5_N: U3.F5(IO_L55N_M3A14_3) ; port VME_IRQ5_N
VME_IRQ6_N: U3.G6(IO_L55P_M3A13_3) ; port VME_IRQ6_N
VME_IRQ7_N: U3.F3(IO_L51N_M3A4_3) ; port VME_IRQ7_N
VME_LWORD_N: U3.M1(IO_L38N_M3DQ3_3) ; port VME_LWORD_N
VME_SERCLK: U3.K4(IO_L43N_GCLK22_IRDY2) ; port VME_SERCLK
VME_SERDAT: U3.G4(IO_L51P_M3A10_3) ; port VME_SERDAT
VME_SYSCLK: U3.K5(IO_L43P_GCLK23_M3RAS) ; port VME_SYSCLK
VME_SYSFAIL_N: U3.N3(IO_L37P_M3DQ0_3) ; port VME_SYSFAIL_N
VME_SYSRESET_N: U3.M2(IO_L38P_M3DQ2_3) ; port VME_SYSRESET_N
VME_WRITE_N: U3.K7(IO_L57P_3) ; port VME_WRITE_N
NetU3_C21: U3.C21(VCCO_1) U3.E19(VCCO_1) U3.G21(VCCO_1) U3.J18(VCCO_1) U3.L16(VCCO_1) U3.L21(VCCO_1) U3.N18(VCCO_1) U3.R21(VCCO_1) U3.U18(VCCO_1) U3.W21(VCCO_1)

Not connected (* = marked no-connect by the designer): JP7 1 3; U3 B22(IO_L19N_1) C19(IO_L1P_A25_1) D1(IO_L53N_M3A12_3) H5(IO_L49N_M3A2_3) H6(IO_L49P_M3A7_3) M7(IO_L23P_3) M8(IO_L23N_3) N22(IO_L47N_LDC_M1DQ1_1) P7(IO_L7N_3) P21(IO_L48P_HDC_M1DQ8_1) T20(IO_L74N_DOUT_BUSY_1)

### Notes on the sheet
- FPGA Bank 1 & 3
- Freely moved
  within GCLK
- Try to use
  all GCLK
- HDC
- LDC
- Freely moved
  within Bank 0 & 1 & 2
- Freely moved
  within Bank 3
  But try to keep Differential Pairs together on connector
- DES
- HES-SO // Valais Wallis
- HAUTE ECOLE VALAISANNE
- /
- REV
- {Path}

### Library data of the parts
JP7 = JUMPER-SMD3: Value: Voltage_Bank_0

## Sheet FPGA Config.SCHDOC: FPGA Rack
size 420 x 297 mm; DrawnBy: zas; Revision: V1.0; SheetNumber: 7; SheetTotal: 25; DocumentName: FPGA Config.SCHDOC
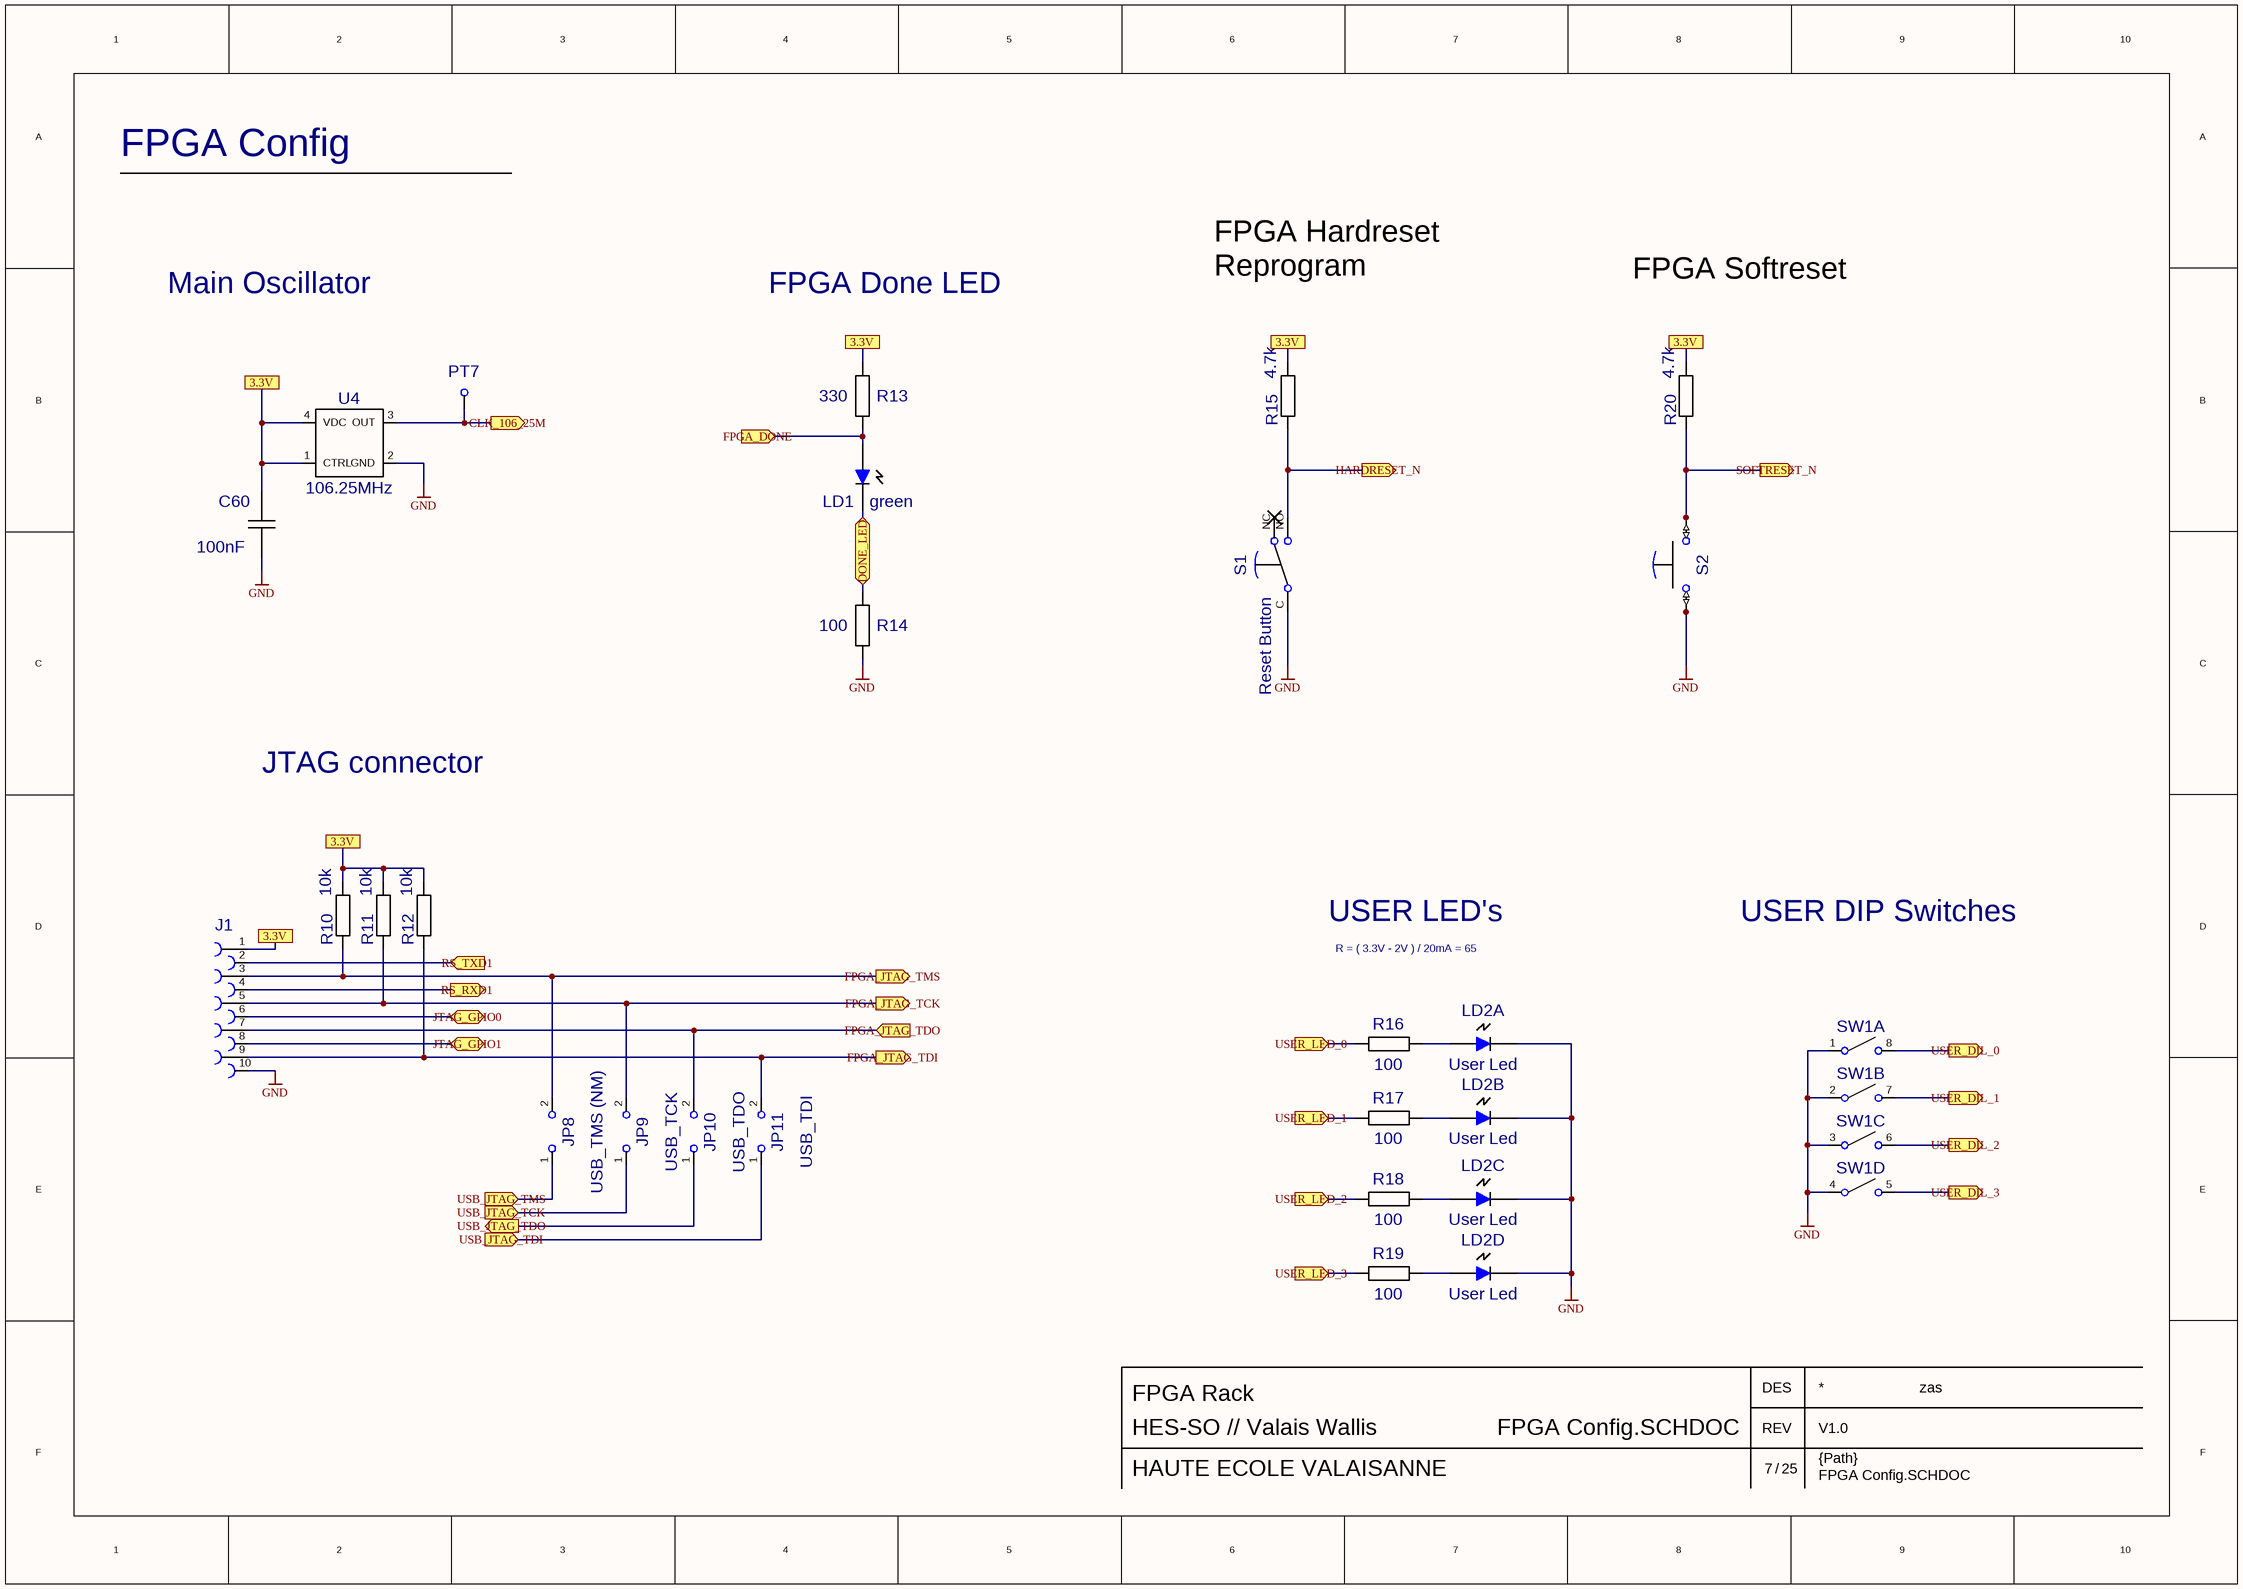
[diagram p7: FPGA Config.SCHDOC]

### Parts
C60  value 100nF  [CC0805-MM]  (hidden comment: CAPS0805-MM)
J1  CONNB2X5-2MM-COUDE  [CONN2X5-2MM-FCI-COUDE]  (value not drawn)
JP8  value USB_TMS (NM)  [JUMPER-SMD]  (hidden comment: JUMPER-SMD)
JP9  value USB_TCK  [JUMPER-SMD]  (hidden comment: JUMPER-SMD)
JP10  value USB_TDO  [JUMPER-SMD]  (hidden comment: JUMPER-SMD)
JP11  value USB_TDI  [JUMPER-SMD]  (hidden comment: JUMPER-SMD)
LD1  value green  [LED_SMD0805-MM]  (hidden comment: LED0805-MM)
LD2  value User Led  [LED-569-010X-XXX]  (hidden comment: LED-569-010X-XXX)  (parts A,B,C,D of 4)
PT7  PTEST  [CONN1X1M]  (value not drawn)
R10  value 10k  [RC0805-MM]  (hidden comment: RS0805-MM)
R11  value 10k  [RC0805-MM]  (hidden comment: RS0805-MM)
R12  value 10k  [RC0805-MM]  (hidden comment: RS0805-MM)
R13  value 330  [RC0805-MM]  (hidden comment: RS0805-MM)
R14  value 100  [RC0805-MM]  (hidden comment: RS0805-MM)
R15  value 4.7k  [RC0805-MM]  (hidden comment: RS0805-MM)
R16  value 100  [RC0805-MM]  (hidden comment: RS0805-MM)
R17  value 100  [RC0805-MM]  (hidden comment: RS0805-MM)
R18  value 100  [RC0805-MM]  (hidden comment: RS0805-MM)
R19  value 100  [RC0805-MM]  (hidden comment: RS0805-MM)
R20  value 4.7k  [RC0805-MM]  (hidden comment: RS0805-MM)
S1  value Reset Button  [PUSHBUTTON-03]  (hidden comment: PUSHBUTT-SH3-01)
S2  PUSHBUTT-DTSM  [PUSHBUTT-DTSM]  (value not drawn)
SW1  SW-CTS-193-4MS  [SW-CTS-193-4MS]  (value not drawn)  (parts A,B,C,D of 4)
U4  value 106.25MHz  [OSCILL-VX3]  (hidden comment: OSCILL-VX3)

### Ports
3.3V, CLK_106_25M (out), DONE_LED (bidir), FPGA_DONE (in), FPGA_JTAG_TCK (out), FPGA_JTAG_TDI (out), FPGA_JTAG_TDO (in), FPGA_JTAG_TMS (out), HARDRESET_N (out), JTAG_GPIO0 (bidir), JTAG_GPIO1 (bidir), RS_RXD1 (out), RS_TXD1 (in), SOFTRESET_N (out), USB_JTAG_TCK (in), USB_JTAG_TDI (in), USB_JTAG_TDO (out), USB_JTAG_TMS (in), USER_DIL_0 (out), USER_DIL_1 (out), USER_DIL_2 (out), USER_DIL_3 (out), USER_LED_0 (in), USER_LED_1 (in), USER_LED_2 (in), USER_LED_3 (in)

### Nets
GND: C60.1 J1.10 LD2.2(-) LD2.4(-) LD2.6(-) LD2.8(-) R14.2 S1.C S2.1 S2.2 SW1.1 SW1.2 SW1.3 SW1.4 U4.2(GND)
CLK_106_25M: PT7.1(A) U4.3(OUT) ; port CLK_106_25M
DONE_LED: LD1.1(K) R14.1 ; port DONE_LED
FPGA_DONE: LD1.2(A) R13.2 ; port FPGA_DONE
FPGA_JTAG_TCK: J1.5 JP9.2 R11.1 ; port FPGA_JTAG_TCK
FPGA_JTAG_TDI: J1.9 JP11.2 R12.1 ; port FPGA_JTAG_TDI
FPGA_JTAG_TDO: J1.7 JP10.2 ; port FPGA_JTAG_TDO
FPGA_JTAG_TMS: J1.3 JP8.2 R10.1 ; port FPGA_JTAG_TMS
HARDRESET_N: R15.1 S1.NO ; port HARDRESET_N
JTAG_GPIO0: J1.6 ; port JTAG_GPIO0
JTAG_GPIO1: J1.8 ; port JTAG_GPIO1
RS_RXD1: J1.4 ; port RS_RXD1
RS_TXD1: J1.2 ; port RS_TXD1
SOFTRESET_N: R20.1 S2.3 S2.4 ; port SOFTRESET_N
USB_JTAG_TCK: JP9.1 ; port USB_JTAG_TCK
USB_JTAG_TDI: JP11.1 ; port USB_JTAG_TDI
USB_JTAG_TDO: JP10.1 ; port USB_JTAG_TDO
USB_JTAG_TMS: JP8.1 ; port USB_JTAG_TMS
USER_DIL_0: SW1.8 ; port USER_DIL_0
USER_DIL_1: SW1.7 ; port USER_DIL_1
USER_DIL_2: SW1.6 ; port USER_DIL_2
USER_DIL_3: SW1.5 ; port USER_DIL_3
USER_LED_0: R16.1 ; port USER_LED_0
USER_LED_1: R17.1 ; port USER_LED_1
USER_LED_2: R18.1 ; port USER_LED_2
USER_LED_3: R19.1 ; port USER_LED_3
NetC60_2: C60.2 U4.1(CTRL) U4.4(VDC)
NetLD2_1: LD2.1(+) R16.2
NetLD2_3: LD2.3(+) R17.2
NetLD2_5: LD2.5(+) R18.2
NetLD2_7: LD2.7(+) R19.2
NetR10_2: R10.2 R11.2 R12.2

Not connected (* = marked no-connect by the designer): J1 1; R13 1; R15 2; R20 2; S1 NC

### Notes on the sheet
- FPGA Config
- Main Oscillator
- FPGA Done LED
- FPGA Hardreset
  Reprogram
- FPGA Softreset
- JTAG connector
- USER LED's
- USER DIP Switches
- R = ( 3.3V - 2V ) / 20mA = 65
- DES
- HES-SO // Valais Wallis
- HAUTE ECOLE VALAISANNE
- /
- REV
- {Path}

### Library data of the parts
C60 = CAPS0805-MM: Capacitor; Partition: Point-to-point IOs; RefDes2: {RefDes2}; MEZZAONLY: YES
JP8-JP11 = JUMPER-SMD: use: power supply 3.3
LD1 = LED0805-MM: Led smd - Stanley Distrelec N° 25 31 00
LD2 = LED-569-010X-XXX: LED Schurter - Distrelec 25 09 08...
PT7 = PTEST_VARIANT_1: Partition: Point-to-point IOs; RefDes2: {RefDes2}; MEZZAONLY: YES; Value: *
R10-R12 R15 R20 = RS0805-MM: as R7 on sheet FPGA 1
S1 = PUSHBUTT-SH3-01: ITW Switches JPM 1990-0101 / Distrelec 20 15 40; use: cpu reset
S2 = PUSHBUTT-DTSM: Pushbutton NO Schurter type SMS J-leads; Partition: Point-to-point IOs; Value: Button 2; RefDes2: {RefDes2}; MEZZAONLY: YES
SW1 = SW-CTS-193-4MS: Dip switch smd 4 poles - Thomas & Betts - Distrelec 21 04 21
U4 = OSCILL-VX3: Oscillator serie VX3 - Jauch - Distrelec 68 03 82 .. 68 04 00; Partition: Point-to-point IOs; RefDes2: {RefDes2}; MEZZAONLY: YES
J1 = CONNB2X5-2MM-COUDE: Value: *